# EAGLE design toyotune_3s_tsop (EAGLE 5.11)

## Sheet 1 of 4
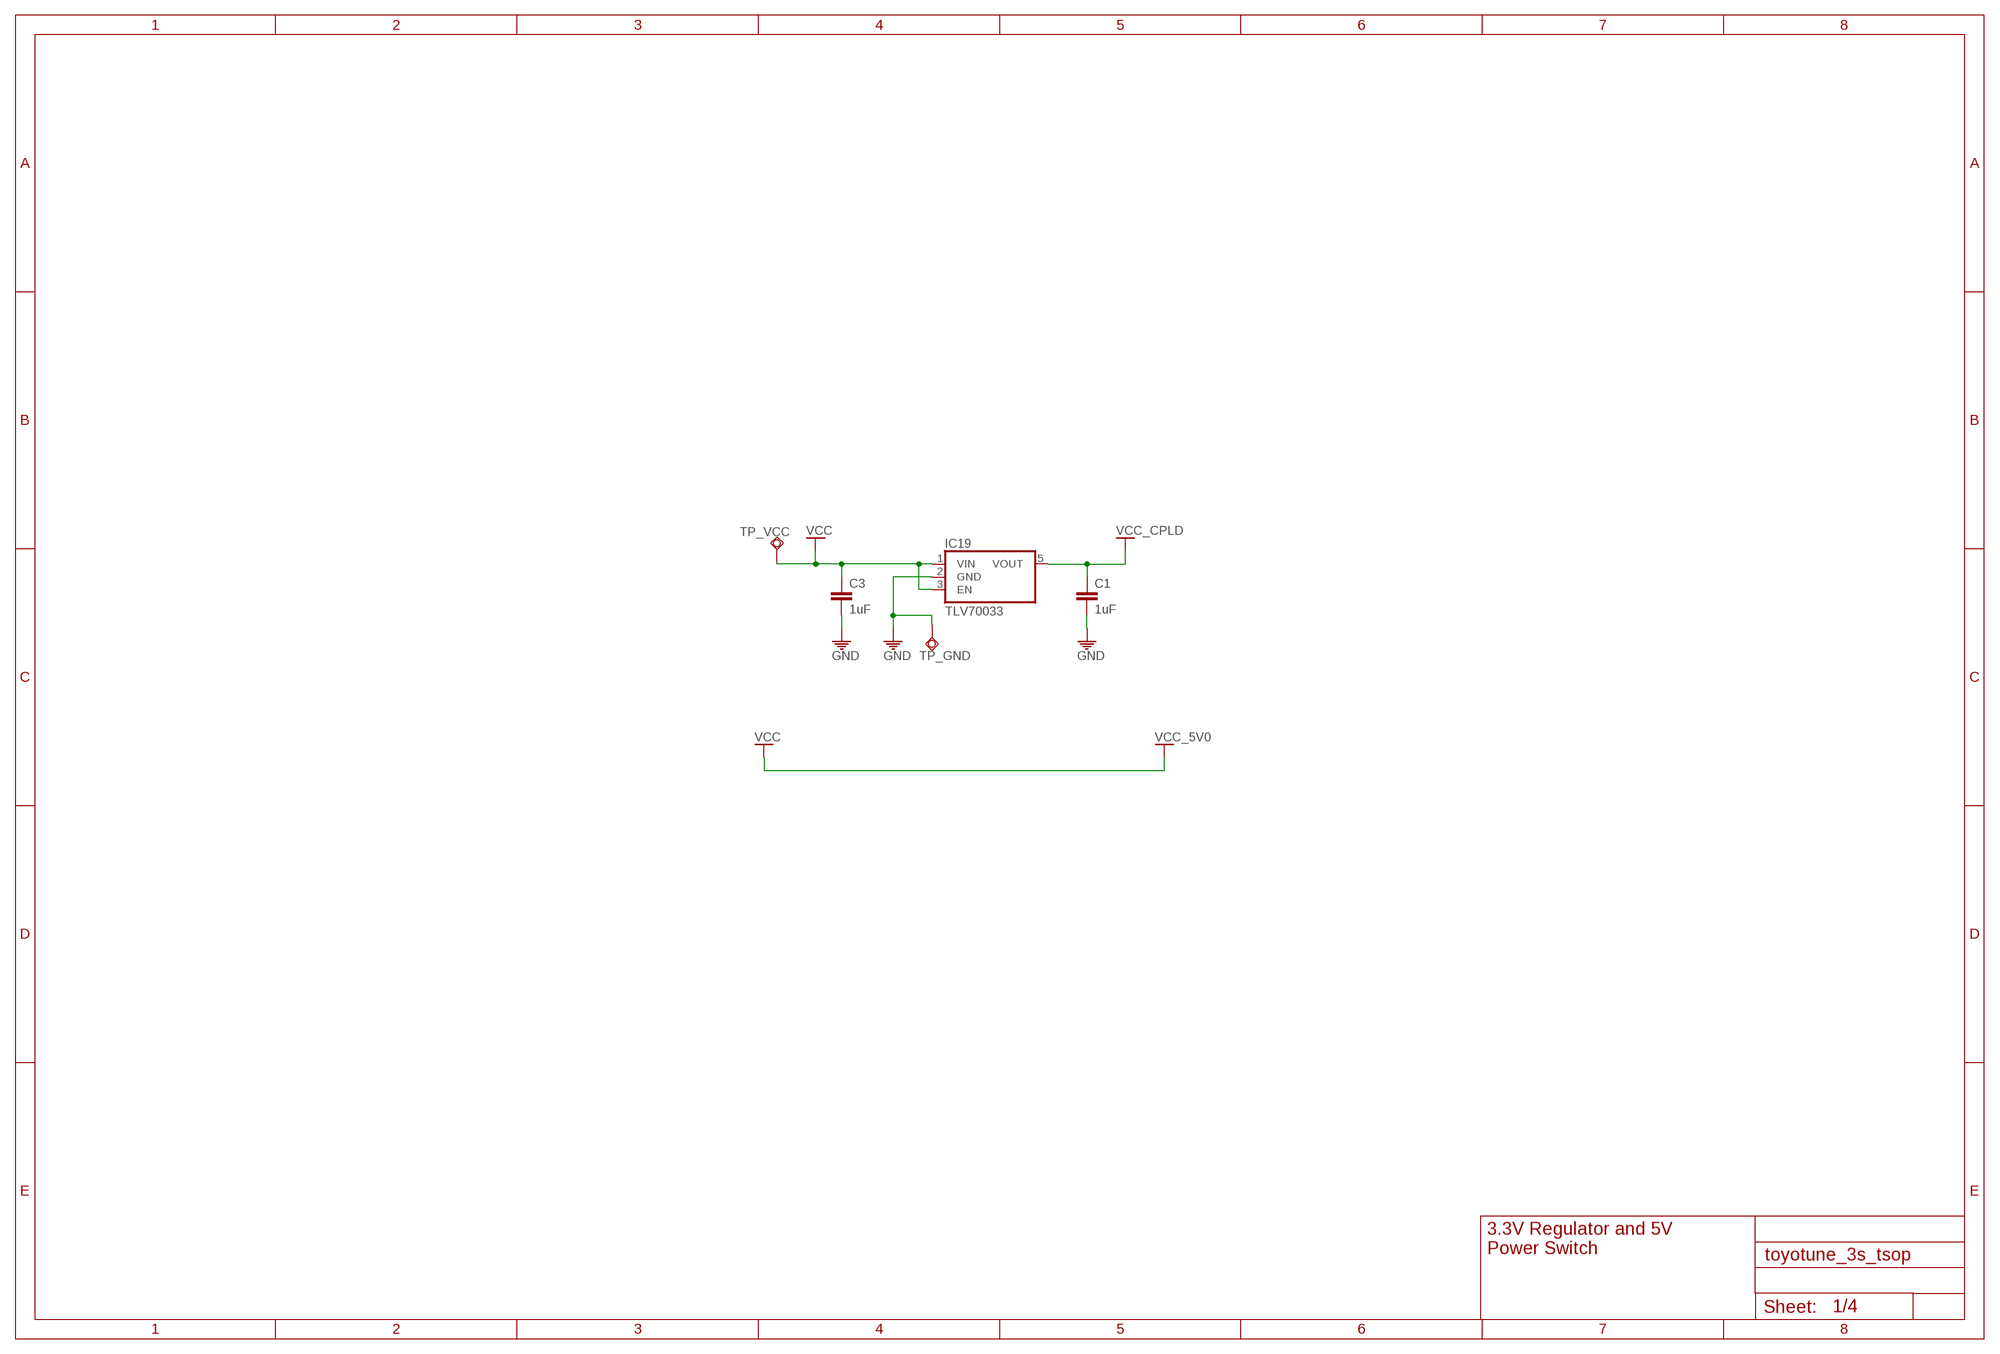
[diagram p0: schematic, sheet 1]

### Parts
C1  1uF  C-EUC0603  [C0603]
C3  1uF  C-EUC0603  [C0603]
IC19  TLV70033  [DDC_R-PDSO-G5]
TP_GND  TPSQTP12SQ  [TP12SQ]
TP_VCC  TPSQTP12SQ  [TP12SQ]

### Nets
GND: C1.2 C3.2 IC19.2(GND) TP_GND.TP ; also sheet 2,3,4
VCC: C3.1 IC19.1(VIN) IC19.3(EN) TP_VCC.TP ; supply symbol labelled VCC_5V0 ; also sheet 2,3,4
VCC_CPLD: C1.1 IC19.5(VOUT) ; also sheet 3,4

### Notes on the sheet
- 3.3V Regulator and 5V
- Power Switch

## Sheet 2 of 4
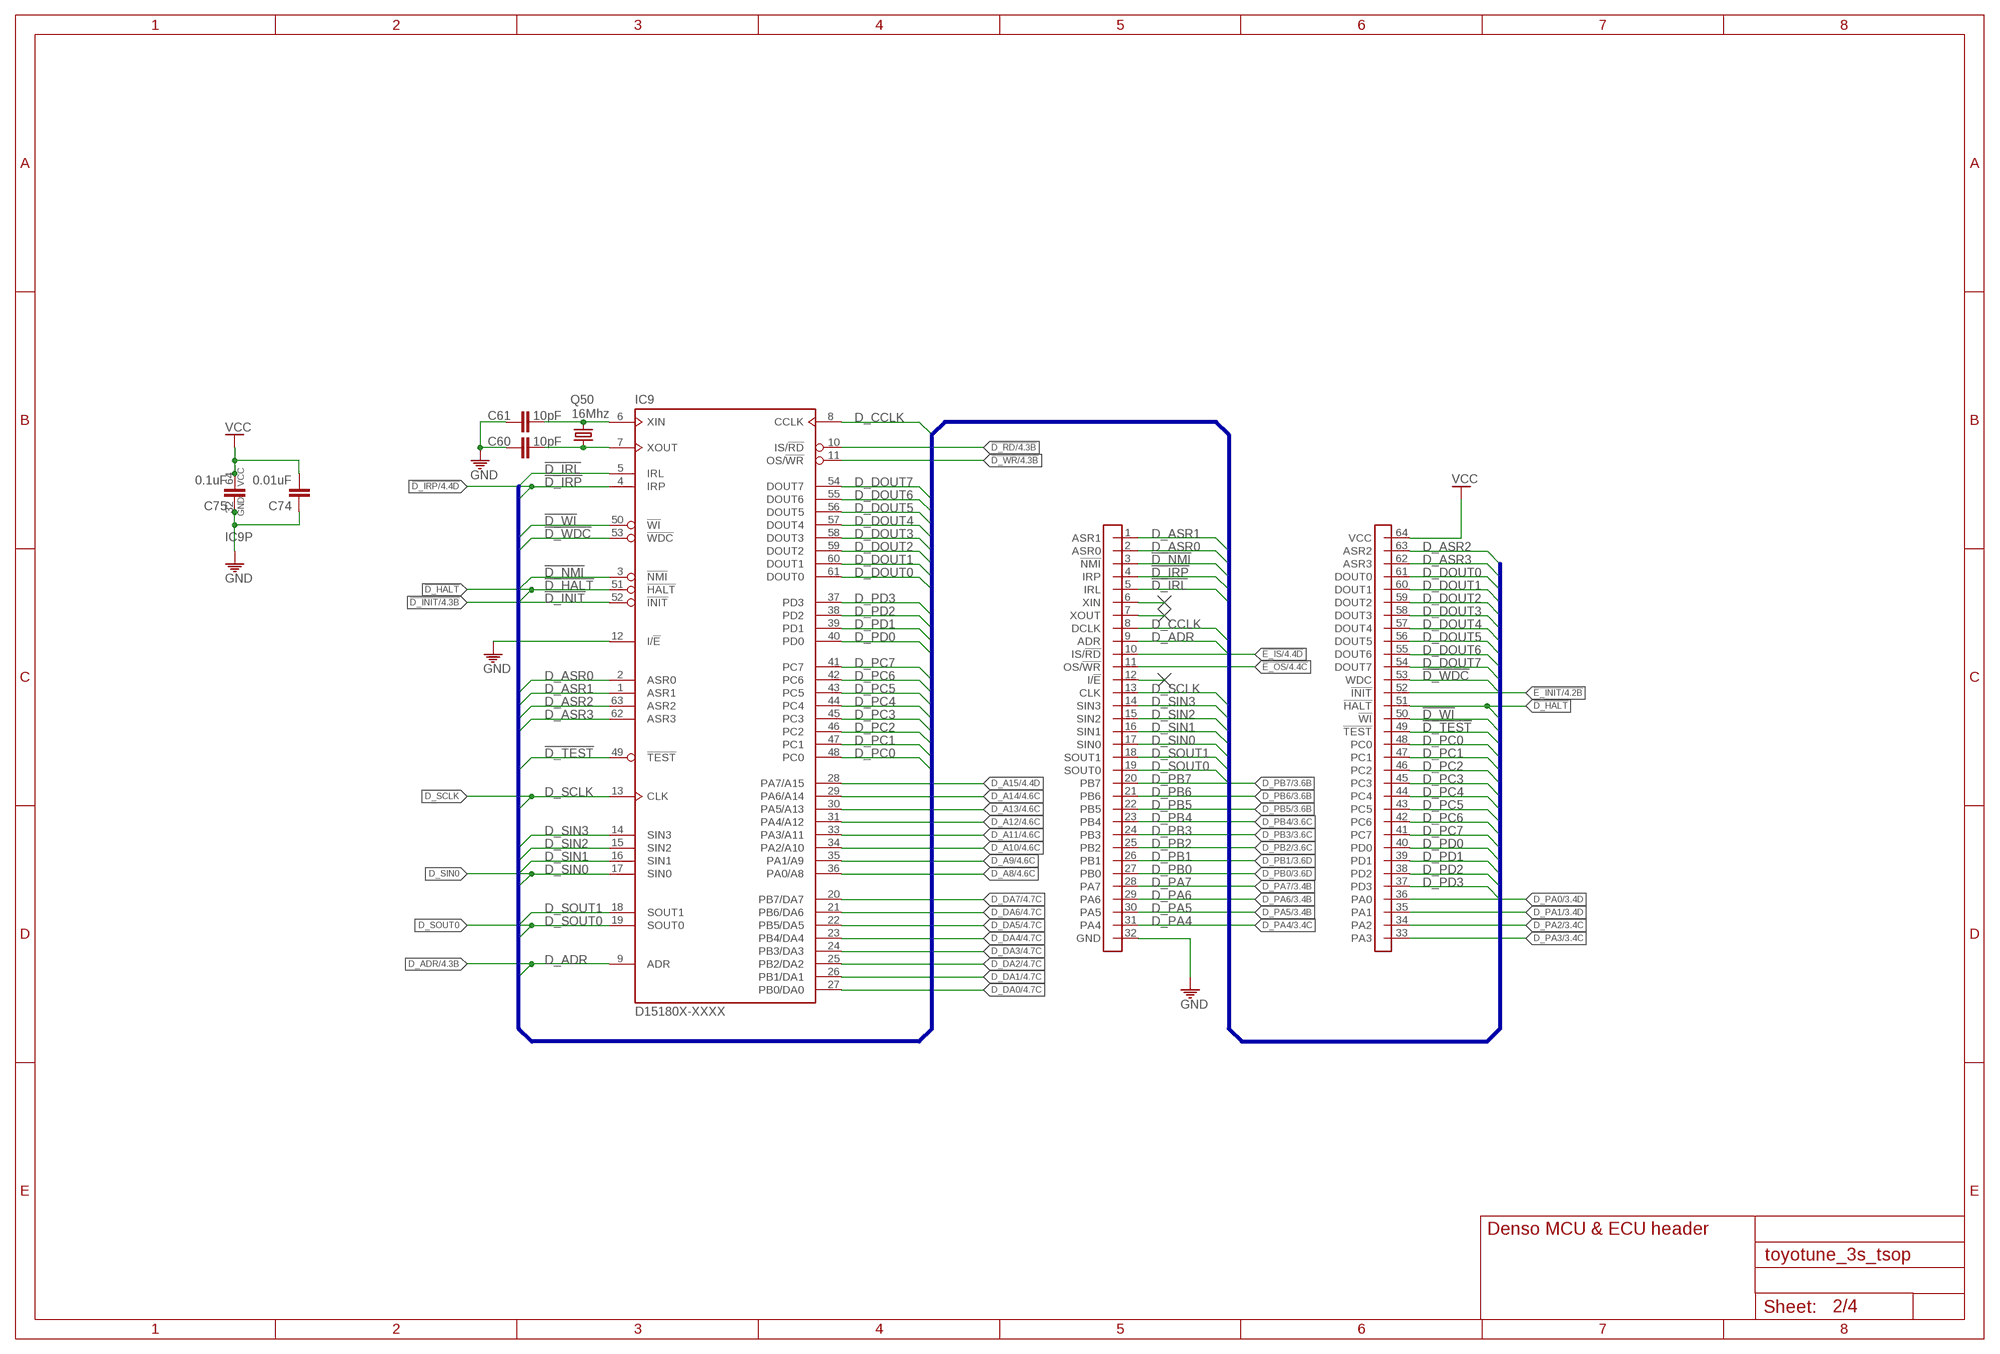
[diagram p1: schematic, sheet 2]

### Parts
C60  10pF  C-EUC0603  [C0603]
C61  10pF  C-EUC0603  [C0603]
C74  0.01uF  C-EUC0603  [C0603]
C75  0.1uF  C-EUC0603  [C0603]
IC9  D15180X-XXXX  D151803-9661  [SDIP-64]
Q50  16Mhz  CRYSTAL5X3  [CRYSTAL-SMD-5X3]
U1  D151803-CONN  [SDIP-64-CONN]

### Nets
!D_HALT: IC9.51(:!HALT) U1.51(!HALT)
!D_INIT: IC9.52(:!INIT) ; also sheet 4
!D_IRL: IC9.5(:IRL) U1.5(IRL)
!D_IRP: IC9.4(:IRP) U1.4(IRP) ; also sheet 4
!D_NMI: IC9.3(:!NMI) U1.3(!NMI)
!D_RD: IC9.10(:IS/!RD) ; also sheet 4
!D_TEST: IC9.49(:!TEST) U1.49(!TEST)
!D_WDC: IC9.53(:!WDC) U1.53(WDC)
!D_WI: IC9.50(:!WI) U1.50(!WI)
!D_WR: IC9.11(:OS/!WR) ; also sheet 4
!E_INIT: U1.52(!INIT) ; also sheet 4
!E_IS: U1.10(IS/!RD) ; also sheet 4
!E_OS: U1.11(OS/!WR) ; also sheet 4
D1_XIN: C61.2 IC9.6(:XIN) Q50.3
D1_XOUT: C60.1 IC9.7(:XOUT) Q50.1
D_A8: IC9.36(:PA0/A8) ; also sheet 4
D_A9: IC9.35(:PA1/A9) ; also sheet 4
D_A10: IC9.34(:PA2/A10) ; also sheet 4
D_A11: IC9.33(:PA3/A11) ; also sheet 4
D_A12: IC9.31(:PA4/A12) ; also sheet 4
D_A13: IC9.30(:PA5/A13) ; also sheet 4
D_A14: IC9.29(:PA6/A14) ; also sheet 4
D_A15: IC9.28(:PA7/A15) ; also sheet 4
D_ADR: IC9.9(:ADR) U1.9(ADR) ; also sheet 4
D_ASR0: IC9.2(:ASR0) U1.2(ASR0)
D_ASR1: IC9.1(:ASR1) U1.1(ASR1)
D_ASR2: IC9.63(:ASR2) U1.63(ASR2)
D_ASR3: IC9.62(:ASR3) U1.62(ASR3)
D_CCLK: IC9.8(:CCLK) U1.8(DCLK) ; also sheet 4
D_DA0: IC9.27(:PB0/DA0) ; also sheet 4
D_DA1: IC9.26(:PB1/DA1) ; also sheet 4
D_DA2: IC9.25(:PB2/DA2) ; also sheet 4
D_DA3: IC9.24(:PB3/DA3) ; also sheet 4
D_DA4: IC9.23(:PB4/DA4) ; also sheet 4
D_DA5: IC9.22(:PB5/DA5) ; also sheet 4
D_DA6: IC9.21(:PB6/DA6) ; also sheet 4
D_DA7: IC9.20(:PB7/DA7) ; also sheet 4
D_DOUT0: IC9.61(:DOUT0) U1.61(DOUT0)
D_DOUT1: IC9.60(:DOUT1) U1.60(DOUT1)
D_DOUT2: IC9.59(:DOUT2) U1.59(DOUT2)
D_DOUT3: IC9.58(:DOUT3) U1.58(DOUT3)
D_DOUT4: IC9.57(:DOUT4) U1.57(DOUT4)
D_DOUT5: IC9.56(:DOUT5) U1.56(DOUT5)
D_DOUT6: IC9.55(:DOUT6) U1.55(DOUT6)
D_DOUT7: IC9.54(:DOUT7) U1.54(DOUT7)
D_PA0: U1.36(PA0) ; also sheet 3
D_PA1: U1.35(PA1) ; also sheet 3
D_PA2: U1.34(PA2) ; also sheet 3
D_PA3: U1.33(PA3) ; also sheet 3
D_PA4: U1.31(PA4) ; also sheet 3
D_PA5: U1.30(PA5) ; also sheet 3
D_PA6: U1.29(PA6) ; also sheet 3
D_PA7: U1.28(PA7) ; also sheet 3
D_PB0: U1.27(PB0) ; also sheet 3
D_PB1: U1.26(PB1) ; also sheet 3
D_PB2: U1.25(PB2) ; also sheet 3
D_PB3: U1.24(PB3) ; also sheet 3
D_PB4: U1.23(PB4) ; also sheet 3
D_PB5: U1.22(PB5) ; also sheet 3
D_PB6: U1.21(PB6) ; also sheet 3
D_PB7: U1.20(PB7) ; also sheet 3
D_PC0: IC9.48(:PC0) U1.48(PC0)
D_PC1: IC9.47(:PC1) U1.47(PC1)
D_PC2: IC9.46(:PC2) U1.46(PC2)
D_PC3: IC9.45(:PC3) U1.45(PC3)
D_PC4: IC9.44(:PC4) U1.44(PC4)
D_PC5: IC9.43(:PC5) U1.43(PC5)
D_PC6: IC9.42(:PC6) U1.42(PC6)
D_PC7: IC9.41(:PC7) U1.41(PC7)
D_PD0: IC9.40(:PD0) U1.40(PD0)
D_PD1: IC9.39(:PD1) U1.39(PD1)
D_PD2: IC9.38(:PD2) U1.38(PD2)
D_PD3: IC9.37(:PD3) U1.37(PD3)
D_SCLK: IC9.13(:CLK) U1.13(CLK)
D_SIN0: IC9.17(:SIN0) U1.17(SIN0)
D_SIN1: IC9.16(:SIN1) U1.16(SIN1)
D_SIN2: IC9.15(:SIN2) U1.15(SIN2)
D_SIN3: IC9.14(:SIN3) U1.14(SIN3)
D_SOUT0: IC9.19(:SOUT0) U1.19(SOUT0)
D_SOUT1: IC9.18(:SOUT1) U1.18(SOUT1)
GND: C60.2 C61.1 C74.1 C75.1 IC9.12(:I/!E) IC9.32(P:GND) U1.32(GND) ; also sheet 1,3,4
N$28: U1.6(XIN)
N$29: U1.7(XOUT)
N$30: U1.12(I/!E)
VCC: C74.2 C75.2 IC9.64(P:VCC) U1.64(VCC) ; also sheet 1,3,4

### Buses
!D_IRL,!D_IRP,!D_WI,!D_WDC,!D_NMI,!D_HALT,!D1_INIT,D_ASR[0..3],!D_TEST,D_PC[0..7],D_PD[0..3],D_ADR,D_SIN[0..3],D_SOUT[0..1],D_SCLK,D_CCLK,D_DOUT[0..7]

### Notes on the sheet
- Denso MCU & ECU header

## Sheet 3 of 4
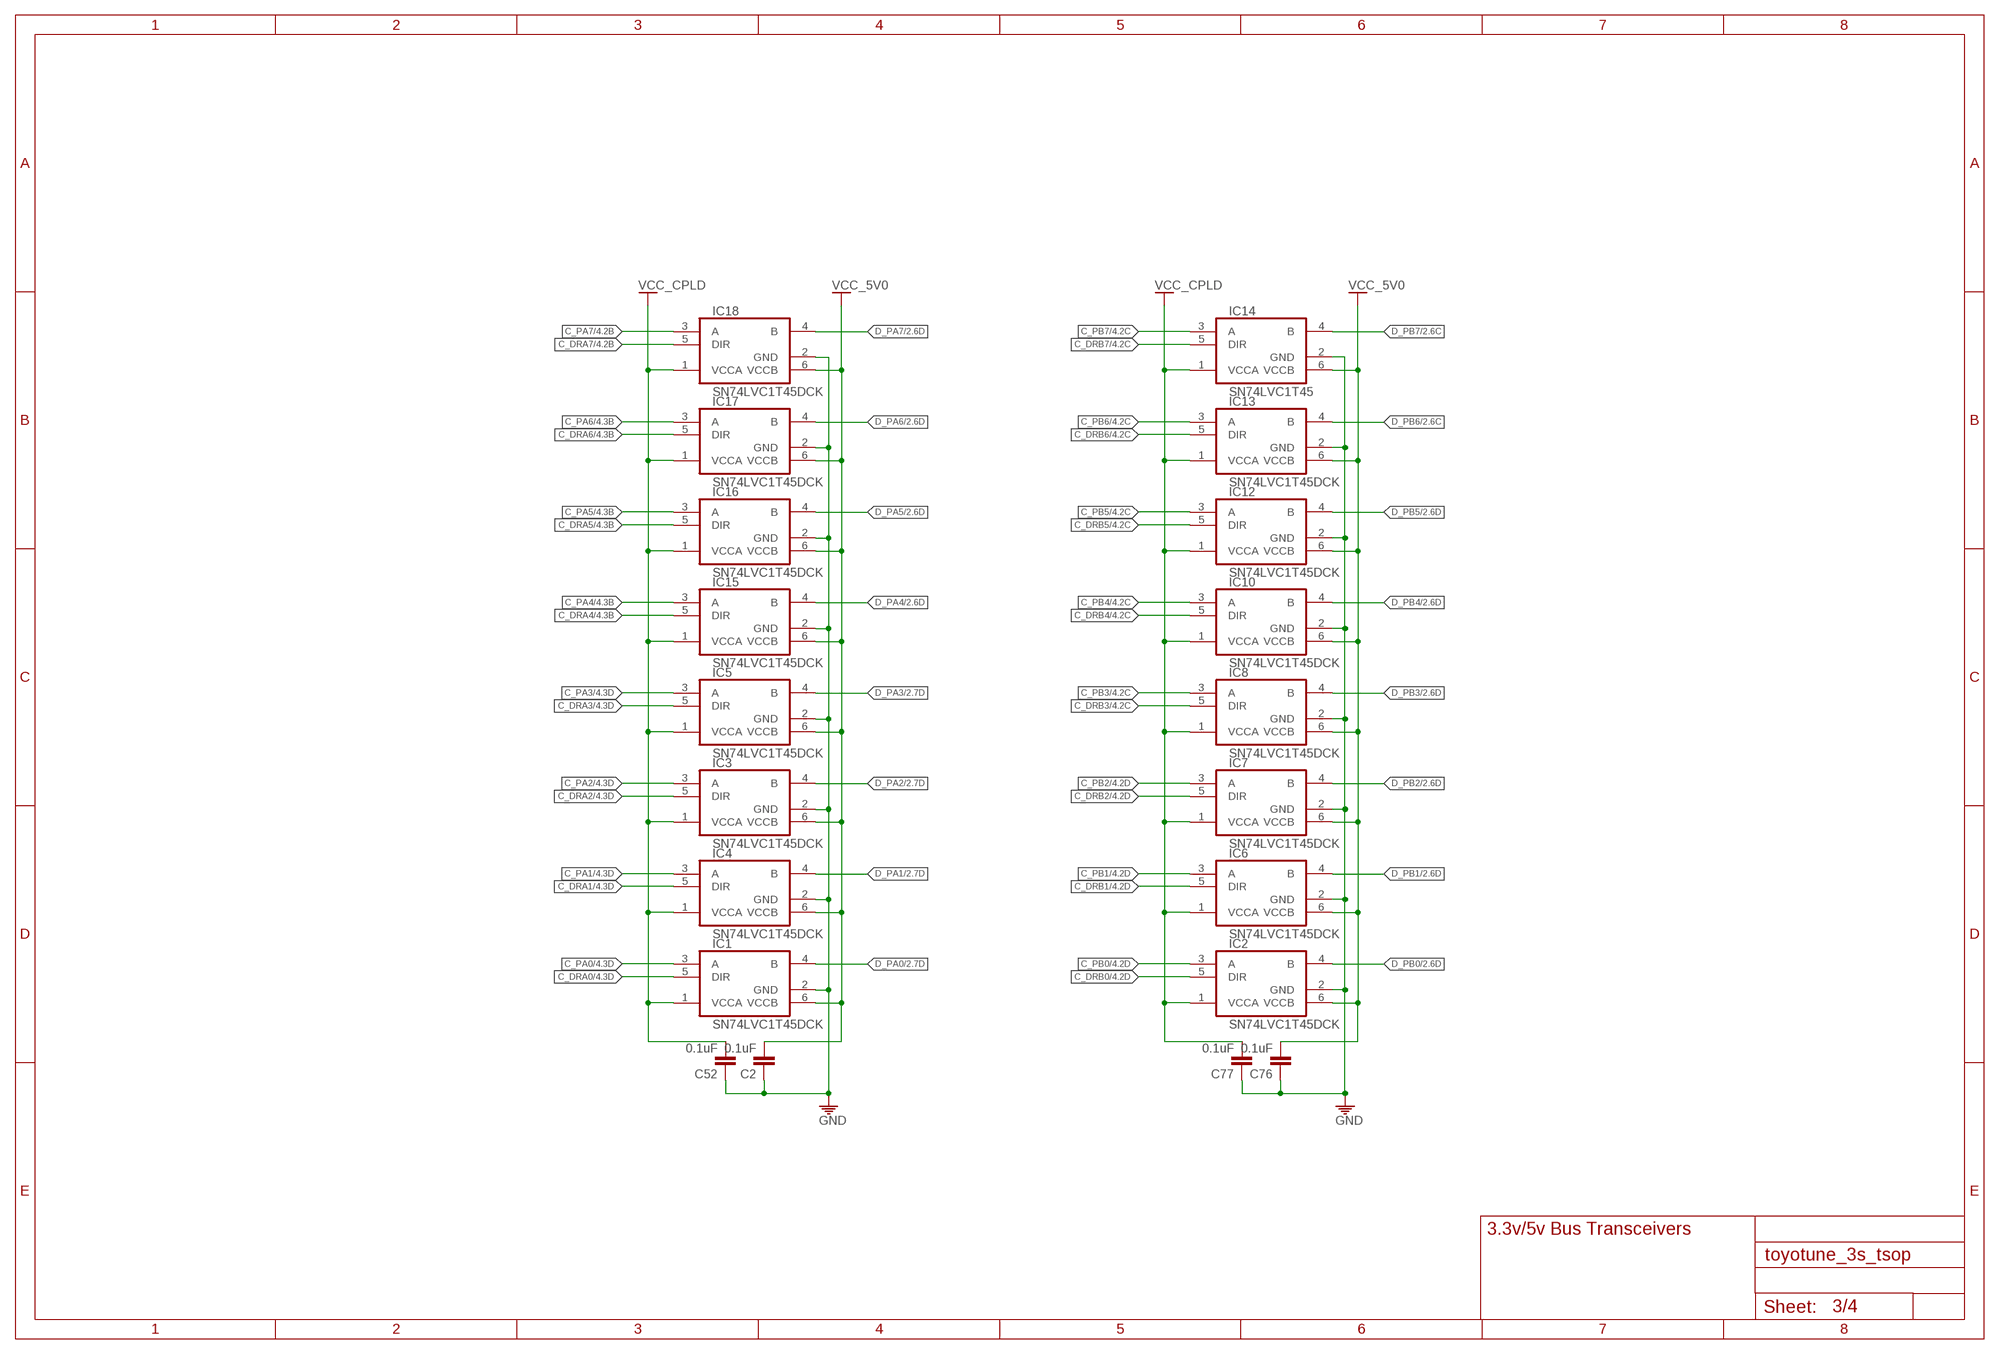
[diagram p2: schematic, sheet 3]

### Parts
C2  0.1uF  C-EUC0603  [C0603]
C52  0.1uF  C-EUC0603  [C0603]
C76  0.1uF  C-EUC0603  [C0603]
C77  0.1uF  C-EUC0603  [C0603]
IC1  SN74LVC1T45DCK  [DCK_R-PDSO-G6]
IC2  SN74LVC1T45DCK  [DCK_R-PDSO-G6]
IC3  SN74LVC1T45DCK  [DCK_R-PDSO-G6]
IC4  SN74LVC1T45DCK  [DCK_R-PDSO-G6]
IC5  SN74LVC1T45DCK  [DCK_R-PDSO-G6]
IC6  SN74LVC1T45DCK  [DCK_R-PDSO-G6]
IC7  SN74LVC1T45DCK  [DCK_R-PDSO-G6]
IC8  SN74LVC1T45DCK  [DCK_R-PDSO-G6]
IC10  SN74LVC1T45DCK  [DCK_R-PDSO-G6]
IC12  SN74LVC1T45DCK  [DCK_R-PDSO-G6]
IC13  SN74LVC1T45DCK  [DCK_R-PDSO-G6]
IC14  SN74LVC1T45  SN74LVC1T45DCK  [DCK_R-PDSO-G6]
IC15  SN74LVC1T45DCK  [DCK_R-PDSO-G6]
IC16  SN74LVC1T45DCK  [DCK_R-PDSO-G6]
IC17  SN74LVC1T45DCK  [DCK_R-PDSO-G6]
IC18  SN74LVC1T45DCK  [DCK_R-PDSO-G6]

### Nets
C_DRA0: IC1.5(DIR) ; also sheet 4
C_DRA1: IC4.5(DIR) ; also sheet 4
C_DRA2: IC3.5(DIR) ; also sheet 4
C_DRA3: IC5.5(DIR) ; also sheet 4
C_DRA4: IC15.5(DIR) ; also sheet 4
C_DRA5: IC16.5(DIR) ; also sheet 4
C_DRA6: IC17.5(DIR) ; also sheet 4
C_DRA7: IC18.5(DIR) ; also sheet 4
C_DRB0: IC2.5(DIR) ; also sheet 4
C_DRB1: IC6.5(DIR) ; also sheet 4
C_DRB2: IC7.5(DIR) ; also sheet 4
C_DRB3: IC8.5(DIR) ; also sheet 4
C_DRB4: IC10.5(DIR) ; also sheet 4
C_DRB5: IC12.5(DIR) ; also sheet 4
C_DRB6: IC13.5(DIR) ; also sheet 4
C_DRB7: IC14.5(DIR) ; also sheet 4
C_PA0: IC1.3(A) ; also sheet 4
C_PA1: IC4.3(A) ; also sheet 4
C_PA2: IC3.3(A) ; also sheet 4
C_PA3: IC5.3(A) ; also sheet 4
C_PA4: IC15.3(A) ; also sheet 4
C_PA5: IC16.3(A) ; also sheet 4
C_PA6: IC17.3(A) ; also sheet 4
C_PA7: IC18.3(A) ; also sheet 4
C_PB0: IC2.3(A) ; also sheet 4
C_PB1: IC6.3(A) ; also sheet 4
C_PB2: IC7.3(A) ; also sheet 4
C_PB3: IC8.3(A) ; also sheet 4
C_PB4: IC10.3(A) ; also sheet 4
C_PB5: IC12.3(A) ; also sheet 4
C_PB6: IC13.3(A) ; also sheet 4
C_PB7: IC14.3(A) ; also sheet 4
D_PA0: IC1.4(B) ; also sheet 2
D_PA1: IC4.4(B) ; also sheet 2
D_PA2: IC3.4(B) ; also sheet 2
D_PA3: IC5.4(B) ; also sheet 2
D_PA4: IC15.4(B) ; also sheet 2
D_PA5: IC16.4(B) ; also sheet 2
D_PA6: IC17.4(B) ; also sheet 2
D_PA7: IC18.4(B) ; also sheet 2
D_PB0: IC2.4(B) ; also sheet 2
D_PB1: IC6.4(B) ; also sheet 2
D_PB2: IC7.4(B) ; also sheet 2
D_PB3: IC8.4(B) ; also sheet 2
D_PB4: IC10.4(B) ; also sheet 2
D_PB5: IC12.4(B) ; also sheet 2
D_PB6: IC13.4(B) ; also sheet 2
D_PB7: IC14.4(B) ; also sheet 2
GND: C2.1 C52.1 C76.1 C77.1 IC1.2(GND) IC2.2(GND) IC3.2(GND) IC4.2(GND) IC5.2(GND) IC6.2(GND) IC7.2(GND) IC8.2(GND) IC10.2(GND) IC12.2(GND) IC13.2(GND) IC14.2(GND) IC15.2(GND) IC16.2(GND) IC17.2(GND) IC18.2(GND) ; also sheet 1,2,4
VCC: C2.2 C76.2 IC1.6(VCCB) IC2.6(VCCB) IC3.6(VCCB) IC4.6(VCCB) IC5.6(VCCB) IC6.6(VCCB) IC7.6(VCCB) IC8.6(VCCB) IC10.6(VCCB) IC12.6(VCCB) IC13.6(VCCB) IC14.6(VCCB) IC15.6(VCCB) IC16.6(VCCB) IC17.6(VCCB) IC18.6(VCCB) ; supply symbol labelled VCC_5V0 ; also sheet 1,2,4
VCC_CPLD: C52.2 C77.2 IC1.1(VCCA) IC2.1(VCCA) IC3.1(VCCA) IC4.1(VCCA) IC5.1(VCCA) IC6.1(VCCA) IC7.1(VCCA) IC8.1(VCCA) IC10.1(VCCA) IC12.1(VCCA) IC13.1(VCCA) IC14.1(VCCA) IC15.1(VCCA) IC16.1(VCCA) IC17.1(VCCA) IC18.1(VCCA) ; also sheet 1,4

### Notes on the sheet
- 3.3v/5v Bus Transceivers

## Sheet 4 of 4
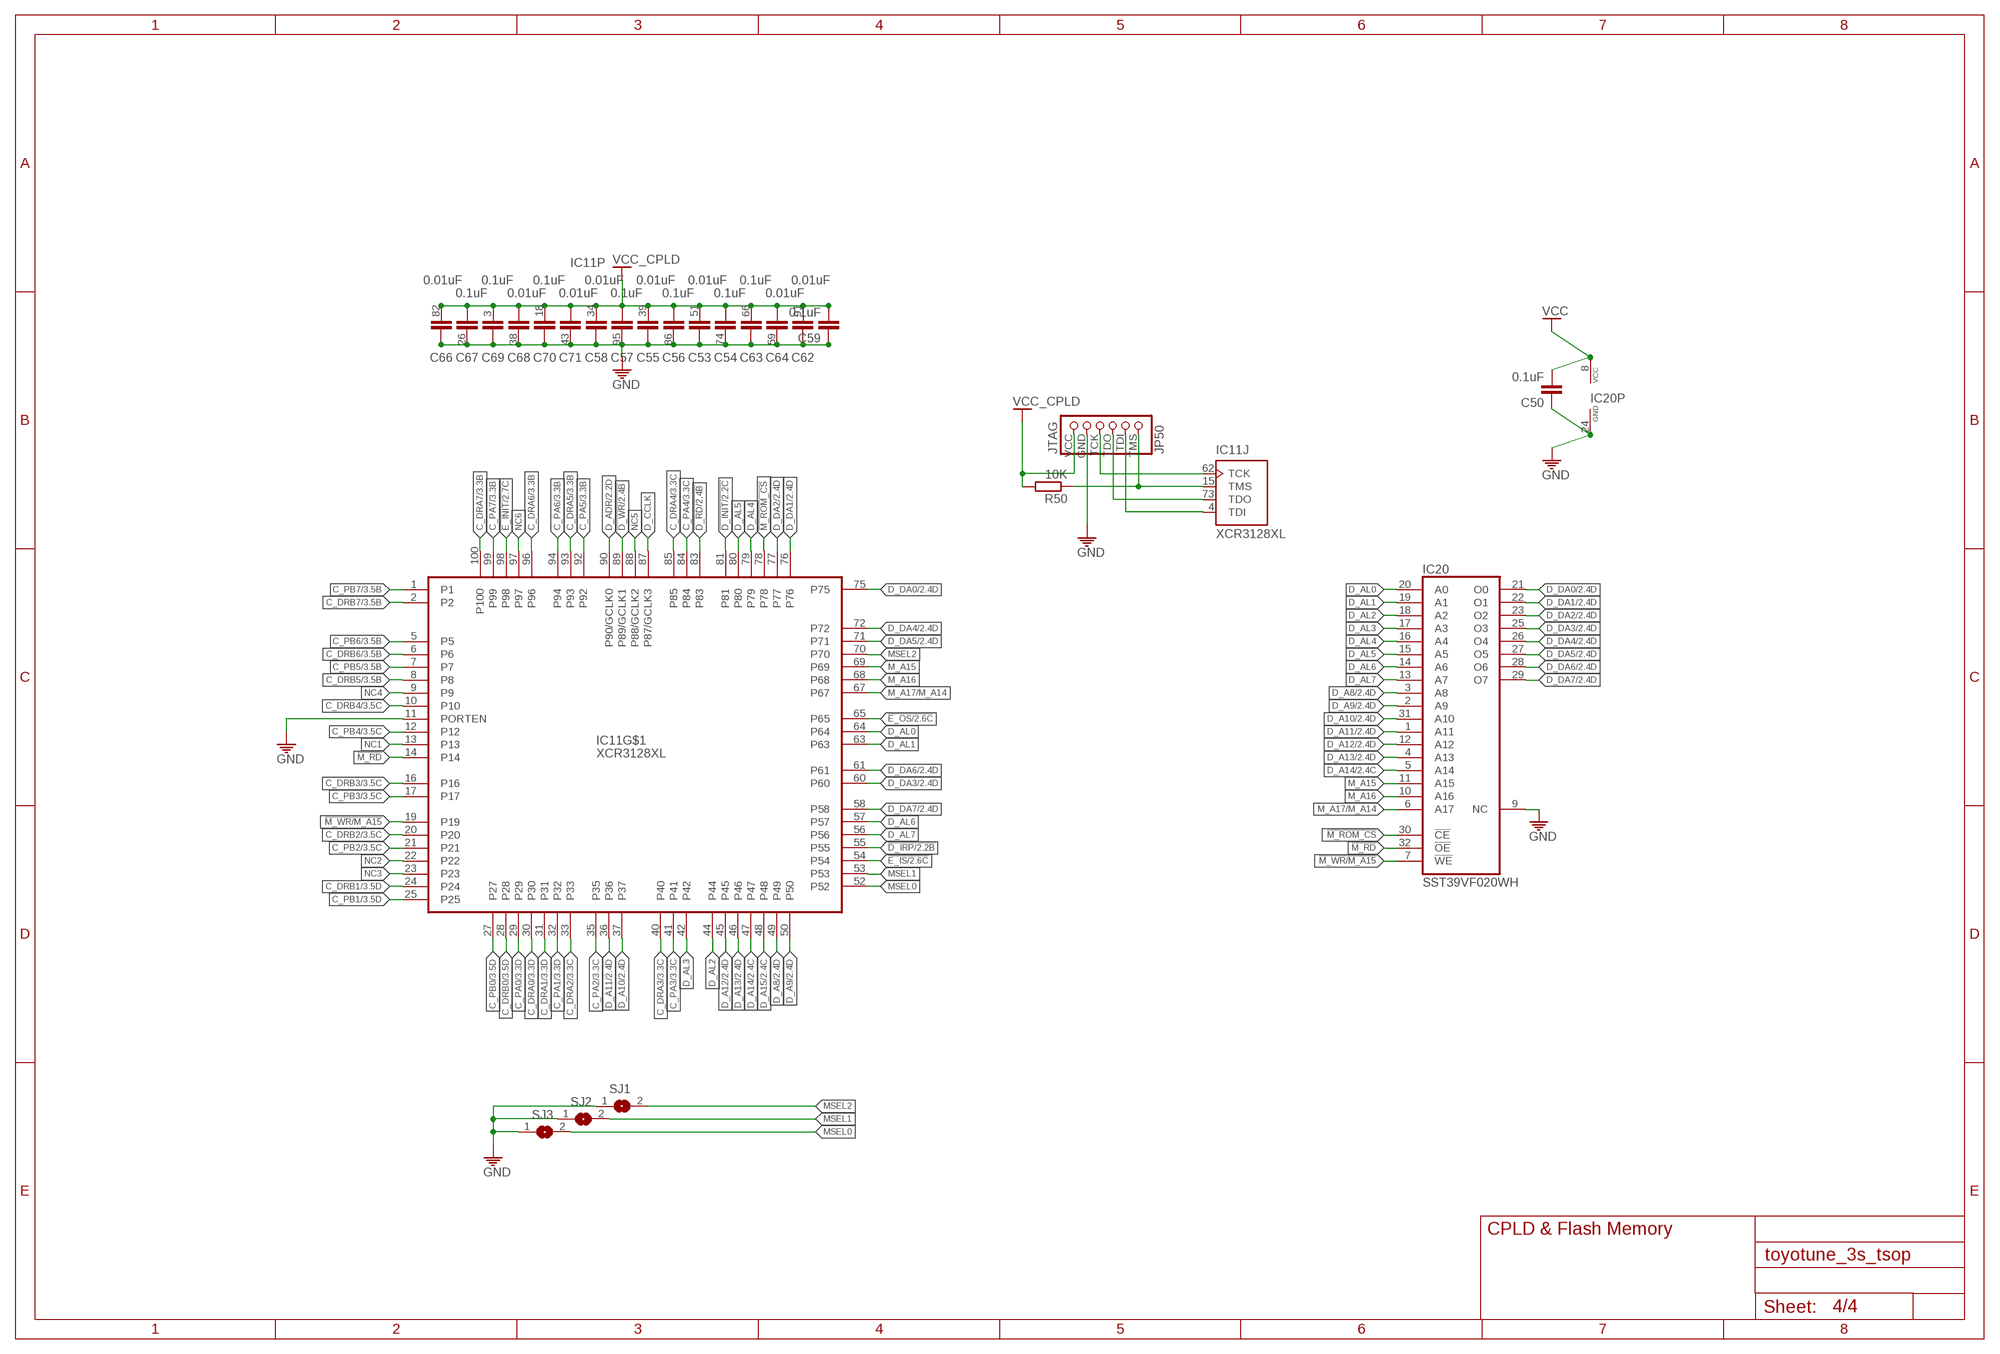
[diagram p3: schematic, sheet 4]

### Parts
C50  0.1uF  C-EUC0603  [C0603]
C53  0.01uF  C-EUC0603  [C0603]
C54  0.1uF  C-EUC0603  [C0603]
C55  0.01uF  C-EUC0603  [C0603]
C56  0.1uF  C-EUC0603  [C0603]
C57  0.1uF  C-EUC0603  [C0603]
C58  0.01uF  C-EUC0603  [C0603]
C59  0.1uF  C-EUC0603  [C0603]
C62  0.01uF  C-EUC0603  [C0603]
C63  0.1uF  C-EUC0603  [C0603]
C64  0.01uF  C-EUC0603  [C0603]
C66  0.01uF  C-EUC0603  [C0603]
C67  0.1uF  C-EUC0603  [C0603]
C68  0.01uF  C-EUC0603  [C0603]
C69  0.1uF  C-EUC0603  [C0603]
C70  0.1uF  C-EUC0603  [C0603]
C71  0.01uF  C-EUC0603  [C0603]
IC11  XCR3128XL  [VQ100]
IC20  SST39VF020WH  [TSOP32]
JP50  JTAG  JTAG_HEADERS  [1X06_SMD]
R50  10K  R-EU_R0603  [R0603]
SJ1  SJ  [SJ]
SJ2  SJ  [SJ]
SJ3  SJ  [SJ]

### Nets
!D_INIT: IC11.81 ; also sheet 2
!D_IRP: IC11.55 ; also sheet 2
!D_RD: IC11.83 ; also sheet 2
!D_WR: IC11.89(P89/GCLK1) ; also sheet 2
!E_INIT: IC11.98 ; also sheet 2
!E_IS: IC11.54 ; also sheet 2
!E_OS: IC11.65 ; also sheet 2
!M_RD: IC11.14 IC20.32(!OE)
!M_ROM_CS: IC11.78 IC20.30(!CE)
!M_WR/M_A15: IC11.19 IC20.7(!WE)
C_DRA0: IC11.30 ; also sheet 3
C_DRA1: IC11.31 ; also sheet 3
C_DRA2: IC11.33 ; also sheet 3
C_DRA3: IC11.40 ; also sheet 3
C_DRA4: IC11.85 ; also sheet 3
C_DRA5: IC11.93 ; also sheet 3
C_DRA6: IC11.96 ; also sheet 3
C_DRA7: IC11.100 ; also sheet 3
C_DRB0: IC11.28 ; also sheet 3
C_DRB1: IC11.24 ; also sheet 3
C_DRB2: IC11.20 ; also sheet 3
C_DRB3: IC11.16 ; also sheet 3
C_DRB4: IC11.10 ; also sheet 3
C_DRB5: IC11.8 ; also sheet 3
C_DRB6: IC11.6 ; also sheet 3
C_DRB7: IC11.2 ; also sheet 3
C_PA0: IC11.29 ; also sheet 3
C_PA1: IC11.32 ; also sheet 3
C_PA2: IC11.35 ; also sheet 3
C_PA3: IC11.41 ; also sheet 3
C_PA4: IC11.84 ; also sheet 3
C_PA5: IC11.92 ; also sheet 3
C_PA6: IC11.94 ; also sheet 3
C_PA7: IC11.99 ; also sheet 3
C_PB0: IC11.27 ; also sheet 3
C_PB1: IC11.25 ; also sheet 3
C_PB2: IC11.21 ; also sheet 3
C_PB3: IC11.17 ; also sheet 3
C_PB4: IC11.12 ; also sheet 3
C_PB5: IC11.7 ; also sheet 3
C_PB6: IC11.5 ; also sheet 3
C_PB7: IC11.1 ; also sheet 3
D_A8: IC11.49 IC20.3(A8) ; also sheet 2
D_A9: IC11.50 IC20.2(A9) ; also sheet 2
D_A10: IC11.37 IC20.31(A10) ; also sheet 2
D_A11: IC11.36 IC20.1(A11) ; also sheet 2
D_A12: IC11.45 IC20.12(A12) ; also sheet 2
D_A13: IC11.46 IC20.4(A13) ; also sheet 2
D_A14: IC11.47 IC20.5(A14) ; also sheet 2
D_A15: IC11.48 ; also sheet 2
D_ADR: IC11.90(P90/GCLK0) ; also sheet 2
D_AL0: IC11.64 IC20.20(A0)
D_AL1: IC11.63 IC20.19(A1)
D_AL2: IC11.44 IC20.18(A2)
D_AL3: IC11.42 IC20.17(A3)
D_AL4: IC11.79 IC20.16(A4)
D_AL5: IC11.80 IC20.15(A5)
D_AL6: IC11.57 IC20.14(A6)
D_AL7: IC11.56 IC20.13(A7)
D_CCLK: IC11.87(P87/GCLK3) ; also sheet 2
D_DA0: IC11.75 IC20.21(O0) ; also sheet 2
D_DA1: IC11.76 IC20.22(O1) ; also sheet 2
D_DA2: IC11.77 IC20.23(O2) ; also sheet 2
D_DA3: IC11.60 IC20.25(O3) ; also sheet 2
D_DA4: IC11.72 IC20.26(O4) ; also sheet 2
D_DA5: IC11.71 IC20.27(O5) ; also sheet 2
D_DA6: IC11.61 IC20.28(O6) ; also sheet 2
D_DA7: IC11.58 IC20.29(O7) ; also sheet 2
GND: C50.1 C53.1 C54.1 C55.1 C56.1 C57.1 C58.1 C59.1 C62.1 C63.1 C64.1 C66.1 C67.1 C68.1 C69.1 C70.1 C71.1 IC11.11(PORTEN) IC11.26(P:GND) IC11.38(P:GND) IC11.43(P:GND) IC11.59(P:GND) IC11.74(P:GND) IC11.86(P:GND) IC11.95(P:GND) IC20.9(NC) IC20.24(GND) JP50.GND SJ1.1 SJ2.1 SJ3.1 ; also sheet 1,2,3
M_A15: IC11.69 IC20.11(A15)
M_A16: IC11.68 IC20.10(A16)
M_A17/M_A14: IC11.67 IC20.6(A17)
MSEL0: IC11.52 SJ3.2
MSEL1: IC11.53 SJ2.2
MSEL2: IC11.70 SJ1.2
NC1: IC11.13
NC2: IC11.22
NC3: IC11.23
NC4: IC11.9
NC5: IC11.88(P88/GCLK2)
NC6: IC11.97
TCK: IC11.62(J:TCK) JP50.TCK
TDI: IC11.4(J:TDI) JP50.TDI
TDO: IC11.73(J:TDO) JP50.TDO
TMS: IC11.15(J:TMS) JP50.TMS R50.1
VCC: C50.2 IC20.8(VCC) ; also sheet 1,2,3
VCC_CPLD: C53.2 C54.2 C55.2 C56.2 C57.2 C58.2 C59.2 C62.2 C63.2 C64.2 C66.2 C67.2 C68.2 C69.2 C70.2 C71.2 IC11.3(P:VCC_3V3) IC11.18(P:VCC_3V3) IC11.34(P:VCC_3V3) IC11.39(P:VCC_3V3) IC11.51(P:VCC_3V3) IC11.66(P:VCC_3V3) IC11.82(P:VCC_3V3) IC11.91(P:VCC_3V3) JP50.VCC R50.2 ; also sheet 1,3

### Notes on the sheet
- CPLD & Flash Memory

## Library data of the parts
C1-C3 C50 C52-C64 C66-C71 C74-C77 = toyotune:C-EU: CAPACITOR, European symbol
IC1-IC8 IC10 IC12-IC18 = toyotune:SN74LVC1T45
IC9 = toyotune:D151803-9661
IC11 = toyotune:XCR3128XL
IC19 = toyota-ecu:TLV70033
IC20 = toyotune:SST39VF020: 2-Megabit FLASH MEMORY (256 K x 8 bit) 2.7-3.6 V
JP50 = toyotune:JTAG_HEADER: PIN HEADER
Q50 = toyotune:CRYSTAL: Crystals Various standard crystals. Proven footprints. Spark Fun Electronics SKU : COM-00534
R50 = toyotune:R-EU_: RESISTOR, European symbol
SJ1-SJ3 = jumper:SJ: SMD solder JUMPER
TP_GND TP_VCC = testpad:TPSQ: Test pad
U1 = toyotune:D151803-CONN

## Board
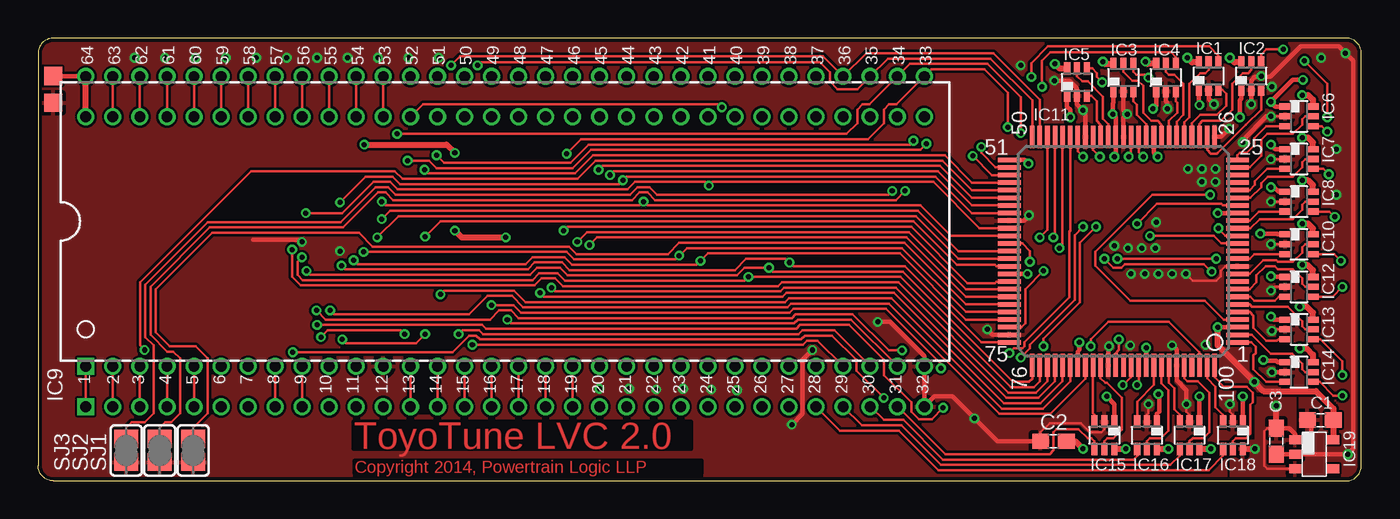
[diagram p4: board, top side]
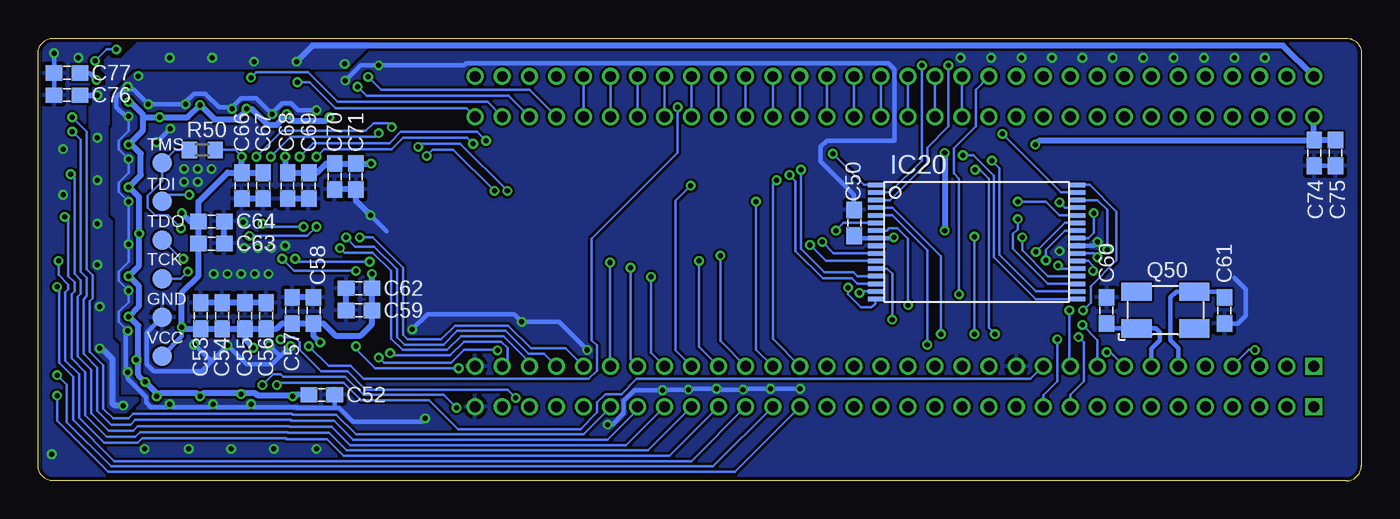
[diagram p5: board, bottom side, seen from below]

Size 87 x 29.1 mm. Coordinates in mm from the lower left corner, seen from the top.
Outline: 1.05,29.1 arc90 0,28.1 0,1 arc90 1,0 86,0 arc90 87,1 87,28.1 arc90 86,29.1 1.05,29.1
Copper layers (1*16): Top 0.035mm / dielectric 1.5mm / Bottom 0.035mm
Design rules "elecrow": minimum track width 6mil, minimum drill 12mil, track to track 6mil, track to pad 6mil, pad to pad 6mil, via to via 6mil, smd to smd 0mil, copper to edge 10mil, drill to drill 10mil, minimum pad ring 8mil, minimum via ring 6mil, stop-mask expansion 2mil, vias tented up to drill 100mil, thermal gap 10mil

### Footprints (pad centres in the part's own frame; a part is rotated, then mirrored left to right if it is on the bottom)
C0603 = smd 1.1 x 1: 1 -0.85,0; 2 0.85,0
DCK_R-PDSO-G6 = smd 0.4 x 0.8: 1 -0.65,-0.9; 2 0,-0.9; 3 0.65,-0.9; 4 0.65,0.9; 5 0,0.9; 6 -0.65,0.9
SDIP-64 = drill 0.711 square: 1 -27.559,-9.525 | drill 0.711 round: 2 -25.781,-9.525; 3 -24.003,-9.525; 4 -22.225,-9.525; 5 -20.447,-9.525; 6 -18.669,-9.525; 7 -16.891,-9.525; 8 -15.113,-9.525; 9 -13.335,-9.525; 10 -11.557,-9.525; 11 -9.779,-9.525; 12 -8.001,-9.525; 13 -6.223,-9.525; 14 -4.445,-9.525; 15 -2.667,-9.525; 16 -0.889,-9.525; 17 0.889,-9.525; 18 2.667,-9.525; 19 4.445,-9.525; 20 6.223,-9.525; 21 8.001,-9.525; 22 9.779,-9.525; 23 11.557,-9.525; 24 13.335,-9.525; 25 15.113,-9.525; 26 16.891,-9.525; 27 18.669,-9.525; 28 20.447,-9.525; 29 22.225,-9.525; 30 24.003,-9.525; 31 25.781,-9.525; 32 27.559,-9.525; 33 27.559,9.525; 34 25.781,9.525; 35 24.003,9.525; 36 22.225,9.525; 37 20.447,9.525; 38 18.669,9.525; 39 16.891,9.525; 40 15.113,9.525; 41 13.335,9.525; 42 11.557,9.525; 43 9.779,9.525; 44 8.001,9.525; 45 6.223,9.525; 46 4.445,9.525; 47 2.667,9.525; 48 0.889,9.525; 49 -0.889,9.525; 50 -2.667,9.525; 51 -4.445,9.525; 52 -6.223,9.525; 53 -8.001,9.525; 54 -9.779,9.525; 55 -11.557,9.525; 56 -13.335,9.525; 57 -15.113,9.525; 58 -16.891,9.525; 59 -18.669,9.525; 60 -20.447,9.525; 61 -22.225,9.525; 62 -24.003,9.525; 63 -25.781,9.525; 64 -27.559,9.525
VQ100 = smd 1.5 x 0.3: 1 -7.5,6; 2 -7.5,5.5; 3 -7.5,5; 4 -7.5,4.5; 5 -7.5,4; 6 -7.5,3.5; 7 -7.5,3; 8 -7.5,2.5; 9 -7.5,2; 10 -7.5,1.5; 11 -7.5,1; 12 -7.5,0.5; 13 -7.5,0; 14 -7.5,-0.5; 15 -7.5,-1; 16 -7.5,-1.5; 17 -7.5,-2; 18 -7.5,-2.5; 19 -7.5,-3; 20 -7.5,-3.5; 21 -7.5,-4; 22 -7.5,-4.5; 23 -7.5,-5; 24 -7.5,-5.5; 25 -7.5,-6; 51 7.5,-6; 52 7.5,-5.5; 53 7.5,-5; 54 7.5,-4.5; 55 7.5,-4; 56 7.5,-3.5; 57 7.5,-3; 58 7.5,-2.5; 59 7.5,-2; 60 7.5,-1.5; 61 7.5,-1; 62 7.5,-0.5; 63 7.5,0; 64 7.5,0.5; 65 7.5,1; 66 7.5,1.5; 67 7.5,2; 68 7.5,2.5; 69 7.5,3; 70 7.5,3.5; 71 7.5,4; 72 7.5,4.5; 73 7.5,5; 74 7.5,5.5; 75 7.5,6 | smd 0.3 x 1.5: 26 -6,-7.5; 27 -5.5,-7.5; 28 -5,-7.5; 29 -4.5,-7.5; 30 -4,-7.5; 31 -3.5,-7.5; 32 -3,-7.5; 33 -2.5,-7.5; 34 -2,-7.5; 35 -1.5,-7.5; 36 -1,-7.5; 37 -0.5,-7.5; 38 0,-7.5; 39 0.5,-7.5; 40 1,-7.5; 41 1.5,-7.5; 42 2,-7.5; 43 2.5,-7.5; 44 3,-7.5; 45 3.5,-7.5; 46 4,-7.5; 47 4.5,-7.5; 48 5,-7.5; 49 5.5,-7.5; 50 6,-7.5; 76 6,7.5; 77 5.5,7.5; 78 5,7.5; 79 4.5,7.5; 80 4,7.5; 81 3.5,7.5; 82 3,7.5; 83 2.5,7.5; 84 2,7.5; 85 1.5,7.5; 86 1,7.5; 87 0.5,7.5; 88 0,7.5; 89 -0.5,7.5; 90 -1,7.5; 91 -1.5,7.5; 92 -2,7.5; 93 -2.5,7.5; 94 -3,7.5; 95 -3.5,7.5; 96 -4,7.5; 97 -4.5,7.5; 98 -5,7.5; 99 -5.5,7.5; 100 -6,7.5
DDC_R-PDSO-G5 = smd 0.6 x 0.8: 1 -0.95,-1.25; 2 0,-1.25; 3 0.95,-1.25; 4 0.95,1.25; 5 -0.95,1.25
TSOP32 = smd 1 x 0.3: 1 -6.7,3.7; 2 -6.7,3.2; 3 -6.7,2.7; 4 -6.7,2.2; 5 -6.7,1.7; 6 -6.7,1.2; 7 -6.7,0.7; 8 -6.7,0.2; 9 -6.7,-0.3; 10 -6.7,-0.8; 11 -6.7,-1.3; 12 -6.7,-1.8; 13 -6.7,-2.3; 14 -6.7,-2.8; 15 -6.7,-3.3; 16 -6.7,-3.8; 17 6.6,-3.8; 18 6.6,-3.3; 19 6.6,-2.8; 20 6.6,-2.3; 21 6.6,-1.8; 22 6.6,-1.3; 23 6.6,-0.8; 24 6.6,-0.3; 25 6.6,0.2; 26 6.6,0.7; 27 6.6,1.2; 28 6.6,1.7; 29 6.6,2.2; 30 6.6,2.7; 31 6.6,3.2; 32 6.6,3.7
1X06_SMD = smd 1.27 x 1.27: GND 3.81,0; TCK 1.27,0; TDI -3.81,0; TDO -1.27,0; TMS -6.35,0; VCC 6.35,0
CRYSTAL-SMD-5X3 = smd 2 x 1.2: 1 -1.9,-1.2; 2 1.9,-1.2; 3 1.9,1.2; 4 -1.9,1.2
R0603 = smd 1 x 1.1: 1 -0.85,0; 2 0.85,0
SJ = smd 1.168 x 1.6: 1 -0.762,0; 2 0.762,0
TP12SQ = smd 1.2 x 1.2: TP 0,0
SDIP-64-CONN = drill 0.711 square: 1 -27.559,-9.525 | drill 0.711 round: 2 -25.781,-9.525; 3 -24.003,-9.525; 4 -22.225,-9.525; 5 -20.447,-9.525; 6 -18.669,-9.525; 7 -16.891,-9.525; 8 -15.113,-9.525; 9 -13.335,-9.525; 10 -11.557,-9.525; 11 -9.779,-9.525; 12 -8.001,-9.525; 13 -6.223,-9.525; 14 -4.445,-9.525; 15 -2.667,-9.525; 16 -0.889,-9.525; 17 0.889,-9.525; 18 2.667,-9.525; 19 4.445,-9.525; 20 6.223,-9.525; 21 8.001,-9.525; 22 9.779,-9.525; 23 11.557,-9.525; 24 13.335,-9.525; 25 15.113,-9.525; 26 16.891,-9.525; 27 18.669,-9.525; 28 20.447,-9.525; 29 22.225,-9.525; 30 24.003,-9.525; 31 25.781,-9.525; 32 27.559,-9.525; 33 27.559,9.525; 34 25.781,9.525; 35 24.003,9.525; 36 22.225,9.525; 37 20.447,9.525; 38 18.669,9.525; 39 16.891,9.525; 40 15.113,9.525; 41 13.335,9.525; 42 11.557,9.525; 43 9.779,9.525; 44 8.001,9.525; 45 6.223,9.525; 46 4.445,9.525; 47 2.667,9.525; 48 0.889,9.525; 49 -0.889,9.525; 50 -2.667,9.525; 51 -4.445,9.525; 52 -6.223,9.525; 53 -8.001,9.525; 54 -9.779,9.525; 55 -11.557,9.525; 56 -13.335,9.525; 57 -15.113,9.525; 58 -16.891,9.525; 59 -18.669,9.525; 60 -20.447,9.525; 61 -22.225,9.525; 62 -24.003,9.525; 63 -25.781,9.525; 64 -27.559,9.525

### Placement (x,y rotation side)
C1  84.3,4 180 top
C2  66.75,2.6 0 top
C3  81.4,2.6 270 top
C50  33.35,16.95 270 bottom
C52  68.35,5.65 180 bottom
C53  76.3,10.85 270 bottom
C54  74.9,10.85 270 bottom
C55  73.4,10.85 270 bottom
C56  72,10.85 270 bottom
C57  70.3,11.2 270 bottom
C58  68.9,11.2 270 bottom
C59  65.9,11.2 0 bottom
C60  16.75,11.2 90 bottom
C61  9,11.2 90 bottom
C62  65.9,12.65 0 bottom
C63  75.6,15.6 180 bottom
C64  75.6,17.05 180 bottom
C66  73.6,19.4 90 bottom
C67  72.2,19.4 90 bottom
C68  70.6,19.4 90 bottom
C69  69.2,19.4 90 bottom
C70  67.5,20 90 bottom
C71  66.1,20 90 bottom
C74  3.1,21.55 90 bottom
C75  1.7,21.55 90 bottom
C76  85.1,25.35 0 bottom
C77  85.1,26.8 0 bottom
IC1  76.95,26.6 0 top
IC2  79.75,26.6 0 top
IC3  71.35,26.5 0 top
IC4  74.15,26.5 0 top
IC5  68.3,26.2 0 top
IC6  82.9,23.95 270 top
IC7  82.9,21.15 270 top
IC8  82.9,18.35 270 top
IC9  30.7,17.05 0 top
IC10  82.9,15.55 270 top
IC11  71.35,15.1 180 top
IC12  82.9,12.75 270 top
IC13  82.9,9.95 270 top
IC14  82.9,7.15 270 top
IC15  70.1,3 180 top
IC16  72.9,3 180 top
IC17  75.7,3 180 top
IC18  78.55,3 180 top
IC19  83.9,1.75 270 top
IC20  25.25,15.75 0 bottom
JP50  78.85,14.55 270 bottom
Q50  12.89,11.22 0 bottom
R50  76.2,21.75 0 bottom
SJ1  10.2,2 90 top
SJ2  8,2 90 top
SJ3  5.8,2 90 top
TP_GND  1,24.85 0 top
TP_VCC  1,26.6 0 top
U1  30.7,14.4 0 top

### Tracks (layer width: path | path; a pad name or v marks a point on that pad's centre or on a via)
!D_HALT
  Bottom 0.178: U1.51 IC9.51
!D_INIT  (via drill 0.33)
  Top 0.178: IC11.81 67.85,6.55 66.05,4.75 63.35,4.75 56.1,12 49.35,12 49.1,11.75 32.05,11.75 31.3,12.5 26.7,12.5 v26.45,12.25
  Bottom 0.178: IC9.52 25.35,25.7 25.35,23.3 26.8,21.85 26.8,20.2 26.45,19.85 v26.45,12.25
!D_IRL
  Top 0.178: U1.5 IC9.5
!D_IRP  (via drill 0.33)
  Top 0.178: U1.4 IC9.4 | IC11.55 61.4,19.1 59.45,21.05 36.65,21.05 35.45,19.85 23.95,19.85 23.45,20.35 14,20.35 6.7,13.05 6.7,8.9 v7,8.6
  Bottom 0.178: IC9.4 8.45,7.55 7.4,8.6 v7,8.6
!D_NMI
  Top 0.178: U1.3 IC9.3
!D_RD  (via drill 0.33)
  Top 0.178: IC11.83 68.85,6.7 66.55,4.4 63.2,4.4 55.95,11.65 49.5,11.65 49.25,11.4 31.9,11.4 31.15,12.15 29.55,12.15 28.35,10.95 19.45,10.95 v19.2,11.2
  Bottom 0.178: IC9.10 19.2,7.58 v19.2,11.2
!D_TEST
  Bottom 0.178: U1.49 IC9.49
!D_WDC
  Top 0.178: U1.53 IC9.53
!D_WI
  Bottom 0.178: U1.50 IC9.50
!D_WR  (via drill 0.33)
  Top 0.178: IC11.89 71.85,6.8 71.3,6.25 v71.3,6.3
  Bottom 0.178: v71.3,6.3 71.15,6.45 66.9,6.45 65.75,5.3 61.3,5.3 59.4,3.4 51.35,3.4 50.25,4.5 50.25,5.15 49.7,5.7 48.65,5.7 47.65,6.7 21.75,6.7 IC9.11
!E_INIT  (via drill 0.33)
  Top 0.178: IC11.98 76.35,8.45 74.35,10.45 70.35,10.45 69.2,9.3 v69.2,8.85 | U1.52 25.3,24.75 44.75,24.75 v44.95,24.55
  Bottom 0.178: v69.2,8.85 67.9,7.55 66.45,7.55 65.6,6.7 50.8,6.7 50.25,7.25 50.25,8.9 50.6,9.25 50.6,15.9 44.95,21.55 v44.95,24.55
!E_IS  (via drill 0.33)
  Top 0.178: IC11.54 61.4,19.6 59.6,21.4 36.5,21.4 35.3,20.2 25.65,20.2 v25.4,20.45 | v18.6,9.45 19.05,9.9 23.85,9.9 v24.1,9.65
  Bottom 0.178: U1.10 19.14,5.66 18.25,6.55 18.25,9.1 v18.6,9.45 | v25.4,20.45 25.1,20.45 24.5,19.85 24.5,10.05 v24.1,9.65
!E_OS  (via drill 0.33)
  Top 0.178: IC11.65 63,14.1 62.9,14.2 60.4,14.2 57.55,17.05 26.45,17.05 v25.45,16.05 | v20,9.3 20.25,9.05 24.85,9.05 v25.45,9.65
  Bottom 0.178: v25.45,9.65 v25.45,16.05 | v20,9.3 20,6.55 20.92,5.63 U1.11
!M_RD  (via drill 0.33)
  Top 0.178: IC11.14 77.8,15.6 77.3,16.1 v73.1,16.1 | v56.8,8.57 55.93,8.57 53.55,10.95 49.8,10.95 49.55,10.7 31.6,10.7 31.1,11.2 30.3,11.2 29.7,10.6 18.9,10.6 v18.3,11.2 | v68.7,16.7 68.15,16.15 68.15,11.9 65.2,8.95 65.2,8.7 v64.6,8.1
  Bottom 0.178: v56.8,8.57 56.77,8.6 59,8.6 59.85,7.75 64.25,7.75 v64.6,8.1 | v73.1,16.1 69.3,16.1 v68.7,16.7 | IC20.32 17.85,19.45 16.1,17.7 16.1,14.5 17.8,12.8 17.8,11.7 v18.3,11.2
!M_ROM_CS  (via drill 0.33)
  Top 0.178: IC11.78 66.35,6.55 65.6,5.8 63.8,5.8 56.55,13.05 48.9,13.05 48.65,12.8 34.5,12.8 34,13.3 33.1,13.3 32.65,12.85 17.25,12.85 16.7,13.4 v16.7,15.2
  Bottom 0.178: IC20.30 17.35,18.45 16.7,17.8 v16.7,15.2
!M_WR/M_A15  (via drill 0.33)
  Top 0.178: IC11.19 77.9,18.1 77.8,18.2 73.55,18.2 v72.25,16.9 | v59.35,7.4 59.35,7.7 55.75,11.3 49.65,11.3 49.4,11.05 31.75,11.05 31.25,11.55 v29.8,11.55 | v66.1,8.85 66.1,9.35 68.5,11.75 68.5,15.65 v69.55,16.7
  Bottom 0.178: v72.25,16.9 72.05,16.7 v69.55,16.7 | v66.1,8.85 66.1,8.65 64.85,7.4 v59.35,7.4 | IC20.7 31.2,16.45 31.05,16.6 30.5,16.6 29.8,15.9 v29.8,11.55
C_DRA0
  Top 0.178: IC11.30 75.35,23.55 75.7,23.9 75.7,26.1 76.4,26.8 76.75,26.8 76.95,27 IC1.5
C_DRA1
  Top 0.178: IC4.5 74.15,26.9 74.35,26.7 74.7,26.7 75.3,26.1 75.3,24.05 74.85,23.6 IC11.31
C_DRA2
  Top 0.178: IC3.5 71.35,26.9 71.95,26.3 72.3,26.3 72.65,25.95 72.65,24.2 73.2,23.65 73.6,23.65 73.85,23.4 IC11.33
C_DRA3
  Top 0.178: IC11.40 70.35,23.45 70,23.8 70,25.25 69,26.25 68.65,26.25 68.3,26.6 IC5.5
C_DRA4
  Top 0.178: IC15.5 70.1,2.6 70.3,2.8 70.7,2.8 71.25,3.35 71.25,5.45 70.25,6.45 70.15,6.45 69.85,6.75 IC11.85
C_DRA5
  Top 0.178: IC16.5 72.9,2.6 73.1,2.8 73.8,2.8 74.3,3.3 74.3,5.95 73.85,6.4 IC11.93
C_DRA6
  Top 0.178: IC17.5 75.7,2.6 75.9,2.8 76.6,2.8 77,3.2 77,5.8 76.25,6.55 75.55,6.55 75.35,6.75 IC11.96
C_DRA7
  Top 0.178: IC18.5 78.55,2.6 78.75,2.8 79.4,2.8 79.7,3.1 79.7,5 79.85,5.15 79.85,5.8 79.45,6.2 77.95,6.2 77.35,6.8 IC11.100
C_DRB0
  Top 0.178: IC11.28 76.35,23.45 76.55,23.65 77.75,23.65 78.5,24.4 78.5,26.1 79.2,26.8 79.55,26.8 79.75,27 IC2.5
C_DRB1
  Top 0.178: IC11.24 79.65,20.6 80.4,21.35 80.4,22.4 80.8,22.8 82.5,22.8 83.1,23.4 83.1,23.75 83.3,23.95 IC6.5
C_DRB2
  Top 0.178: IC11.20 79.7,18.6 80.4,19.3 80.4,19.55 80.85,20 82.5,20 83.1,20.6 83.1,20.95 83.3,21.15 IC7.5
C_DRB3
  Top 0.178: IC11.16 79.7,16.6 80.3,17.2 82.5,17.2 83.1,17.8 83.1,18.15 83.3,18.35 IC8.5
C_DRB4
  Top 0.178: IC11.10 79.65,13.6 80.55,14.5 81.4,14.5 81.5,14.4 82.5,14.4 83.1,15 83.1,15.35 83.3,15.55 IC10.5
C_DRB5
  Top 0.178: IC11.8 79.65,12.6 80.1,13.05 80.1,13.5 80.7,14.1 81.3,14.1 81.5,13.9 82.5,13.9 83.1,13.3 83.1,12.95 83.3,12.75 IC12.5
C_DRB6
  Top 0.178: IC11.6 79.65,11.6 79.8,11.45 82.15,11.45 83.1,10.5 83.1,10.15 83.3,9.95 IC13.5
C_DRB7
  Top 0.178: IC14.5 83.3,7.15 83.1,7.35 83.1,7.7 82.45,8.35 81.05,8.35 79.8,9.6 IC11.2
C_PA0
  Top 0.178: IC1.3 77.85,25.7 78.1,25.45 78.1,24.65 77.5,24.05 76.4,24.05 75.85,23.5 IC11.29
C_PA1
  Top 0.178: IC11.32 74.35,23.65 74.9,24.2 74.9,24.85 74.8,24.95 IC4.3
C_PA2
  Top 0.178: IC3.3 72,24.95 72.25,24.7 72.25,24.05 72.85,23.45 IC11.35
C_PA3
  Top 0.178: IC5.3 69.25,25.3 69.6,24.95 69.6,23.65 69.85,23.4 IC11.41
C_PA4
  Top 0.178: IC15.3 69.45,4.35 69.35,4.45 IC11.84
C_PA5
  Top 0.178: 73.35,7.8 IC11.92 73.35,6.3 72.25,5.2 IC16.3
C_PA6
  Top 0.178: 74.35,7.75 IC11.94 74.35,6.45 74.7,6.1 74.7,4.7 75.05,4.35 IC17.3
C_PA7
  Top 0.178: IC11.99 76.85,6.75 77.4,6.2 77.4,4.85 77.9,4.35 IC18.3
C_PB0
  Top 0.178: IC2.3 80.4,24.4 79.4,23.4 77.55,21.55 77.5,21.5 77.1,21.5 76.85,21.75 IC11.27
C_PB1
  Top 0.178: 78.85,21.4 | 78.85,21.4 79,21.55 79.45,21.55 79.95,22.05 79.95,22.5 80.75,23.3 IC6.3 | IC11.25 78.85,21.4
C_PB2
  Top 0.178: IC7.3 80.8,20.5 80,19.7 80,19.45 79.65,19.1 IC11.21
C_PB3
  Top 0.178: IC11.17 79.65,17.1 80.25,17.7 IC8.3
C_PB4
  Top 0.178: IC10.3 79.95,14.9 79.65,14.6 IC11.12
C_PB5
  Top 0.178: IC11.7 79.7,12.1 79.95,11.85 81.3,11.85 81.55,12.1 IC12.3
C_PB6
  Top 0.178: IC13.3 81.55,9.3 81.45,9.2 80.75,9.2 79.9,10.05 79.9,10.85 79.65,11.1 IC11.5
C_PB7
  Top 0.178: IC14.3 80.75,6.5 79.9,7.35 79.9,8.25 80.05,8.4 80.05,8.8 79.75,9.1 IC11.1
D1_XIN
  Bottom 0.305: IC9.6 12.03,8.73 12.55,9.25 12.55,12.05 12.18,12.42 Q50.3 9.37,12.42 C61.2
D1_XOUT
  Bottom 0.305: IC9.7 13.81,8.69 13.25,9.25 13.25,9.75 13.52,10.02 Q50.1 16.42,10.02 C60.1
D_A8  (via drill 0.33)
  Top 0.178: IC11.49 65.85,25.05 62.8,28.1 54.45,28.1 IC9.36 51.6,27.9 27.75,27.9 v27.15,27.3
  Bottom 0.178: IC20.3 31,18.45 28.55,20.9 28.55,21.9 27.15,23.3 v27.15,27.3
D_A9  (via drill 0.33)
  Top 0.178: IC11.50 65.35,25 62.6,27.75 55.88,27.75 IC9.35 53.88,25.75 52.55,25.75 52.05,26.25 52.05,26.85 51.4,27.5 29.1,27.5 v28.9,27.3
  Bottom 0.178: IC20.2 31,18.95 28.9,21.05 v28.9,27.3
D_A10  (via drill 0.33)
  Top 0.178: IC11.37 71.85,21.45 v71.7,21.3 | v64.6,22.85 64.6,25.2 62.4,27.4 57.31,27.4 IC9.34 54.66,24.75 54.2,24.75 53.85,24.4 53.85,23.5 53.15,22.8 v23.6,22.8
  Bottom 0.178: v71.7,21.3 70.4,22.6 64.85,22.6 v64.6,22.85 | IC20.31 19.75,18.95 v23.6,22.8
D_A11  (via drill 0.33)
  Top 0.178: IC11.36 72.35,21.6 v72.65,21.3 | v63.75,23.25 63.75,25.5 62.2,27.05 58.73,27.05 IC9.33 56.43,24.75 55.95,24.75 55.6,24.4 55.6,23.5 54.55,22.45 35.7,22.45 v34.75,21.5
  Bottom 0.178: v72.65,21.3 70.95,23 65.45,23 64.95,23.5 64,23.5 v63.75,23.25 | IC20.1 32.7,19.45 v34.75,21.5
D_A12  (via drill 0.33)
  Top 0.178: IC11.45 67.85,16.45 67.8,16.4 67.8,12.05 64.85,9.1 64.85,8.85 64.7,8.7 64.15,8.7 v63.85,8.4 | IC9.31 56.48,7.55 53.43,10.6 49.95,10.6 49.7,10.35 31.1,10.35 v30.85,10.6
  Bottom 0.178: v63.85,8.4 63.7,8.25 59.9,8.25 59,9.15 56.55,9.15 56.15,8.75 56.15,7.85 IC9.31 | v30.85,10.6 30.85,13.6 31.2,13.95 IC20.12
D_A13  (via drill 0.33)
  Top 0.178: IC11.46 67.35,15.5 v67.15,15.3 | IC9.30 54.7,7.55 52.35,9.9 50.25,9.9 50,9.65 29.25,9.65 29,9.9 27.9,9.9 v27.65,9.65
  Bottom 0.178: v67.15,15.3 66.85,15 65,15 63.8,13.8 63.8,9.35 63.05,8.6 60.1,8.6 59.2,9.5 56.4,9.5 54.7,7.8 IC9.30 | v27.65,9.65 27.65,14.75 30.85,17.95 IC20.4
D_A14  (via drill 0.33)
  Top 0.178: v66.75,16 66.85,16.1 IC11.47 | IC9.29 52.93,7.55 52.9,7.55 51.25,9.2 50.55,9.2 50.3,8.95 v28.55,8.95
  Bottom 0.178: v66.75,16 66.15,15.4 64.9,15.4 63.4,13.9 63.4,9.45 62.9,8.95 60.35,8.95 59.45,9.85 56.25,9.85 54.75,8.35 53.75,8.35 IC9.29 | v28.55,8.95 28.55,15.15 30.85,17.45 IC20.5
D_A15  (via drill 0.33)
  Top 0.178: IC11.48 66.35,16.5 v65.85,16
  Bottom 0.178: v65.85,16 65,16 63,14 63,9.6 62.7,9.3 60.5,9.3 59.6,10.2 56.1,10.2 54.6,8.7 52.32,8.7 IC9.28
D_ADR  (via drill 0.33)
  Top 0.178: U1.9 IC9.9 | IC11.90 72.35,6.4 v72.25,6.3 | v59.5,4.8 58.75,4.05 57.9,4.05 57.4,4.55 57.4,5.15 55.6,6.95 55.6,7.95 53.3,10.25 50.1,10.25 49.85,10 29.45,10 29.2,10.25 v18.35,10.25
  Bottom 0.178: IC9.9 17.35,7.54 17.35,9.25 v18.35,10.25 | v72.25,6.3 71.55,7 71.05,7 70.9,6.85 66.8,6.85 65.6,5.65 60.35,5.65 v59.5,4.8
D_AL0  (via drill 0.33)
  Top 0.178: IC11.64 60.5,14.6 57.7,17.4 23.7,17.4 v22.3,16
  Bottom 0.178: IC20.20 20.6,13.45 22.3,15.15 v22.3,16
D_AL1  (via drill 0.33)
  Top 0.178: IC11.63 60.5,15.1 57.85,17.75 23.15,17.75 v22.6,17.2
  Bottom 0.178: IC20.19 20.6,12.95 22.9,15.25 22.9,16.25 22.6,16.55 v22.6,17.2
D_AL2  (via drill 0.33)
  Top 0.178: v68.7,21.3 68.35,21.65 IC11.44 | v58.4,22.15 58,21.75 36.35,21.75 35.15,20.55 26.2,20.55 25.7,21.05 v24.3,21.05
  Bottom 0.178: v68.7,21.3 68.2,21.8 63.75,21.8 63,22.55 58.8,22.55 v58.4,22.15 | IC20.18 21.4,12.45 23.8,14.85 23.8,20.55 v24.3,21.05
D_AL3  (via drill 0.33)
  Top 0.178: IC11.42 69.35,21.75 v69.8,21.3 | v57.55,22.35 57.3,22.1 36.2,22.1 35,20.9 26.7,20.9 v26.2,21.4
  Bottom 0.178: v69.8,21.3 68.9,22.2 63.9,22.2 63.15,22.95 58.15,22.95 v57.55,22.35 | IC20.17 21.4,11.95 24.15,14.7 24.15,20.05 25.5,21.4 v26.2,21.4
D_AL4  (via drill 0.33)
  Top 0.178: IC11.79 66.85,6.55 65.75,5.45 63.65,5.45 56.4,12.7 49.05,12.7 48.8,12.45 34,12.45 v33.75,12.7
  Bottom 0.178: IC20.16 31.95,11.65 32.2,11.4 32.9,11.4 33.75,12.25 v33.75,12.7
D_AL5  (via drill 0.33)
  Top 0.178: IC11.80 67.35,6.55 65.9,5.1 63.5,5.1 56.25,12.35 49.2,12.35 48.95,12.1 33.25,12.1 v33,12.35
  Bottom 0.178: IC20.15 32.9,12.45 v33,12.35
D_AL6  (via drill 0.33)
  Top 0.178: IC11.57 61.4,18.1 59.15,20.35 37.85,20.35 v37.6,20.1
  Bottom 0.178: IC20.14 33.15,12.95 33.5,13.3 35.4,13.3 37.2,15.1 37.2,19.7 v37.6,20.1
D_AL7  (via drill 0.33)
  Top 0.178: IC11.56 61.4,18.6 59.3,20.7 37.1,20.7 v36.85,20.45
  Bottom 0.178: IC20.13 33.15,13.45 33.4,13.7 35.3,13.7 36.85,15.25 v36.85,20.45
D_ASR0
  Top 0.178: U1.2 IC9.2
D_ASR1
  Top 0.178: U1.1 IC9.1
D_ASR2
  Top 0.178: U1.63 IC9.63
D_ASR3
  Top 0.178: U1.62 IC9.62
D_CCLK  (via drill 0.33)
  Top 0.178: U1.8 IC9.8 | IC11.87 70.85,8.4 71.05,8.6 v71.05,9.3 | v55.6,5.45 53.8,7.25 53.8,7.95 52.2,9.55 50.4,9.55 50.15,9.3 29.05,9.3 28.8,9.55 28.35,9.55 27.25,8.45 v16.75,8.45
  Bottom 0.178: v71.05,9.3 70.9,9.45 70.15,9.45 69.8,9.1 69.8,8.6 68.4,7.2 66.65,7.2 65.45,6 56.15,6 v55.6,5.45 | IC9.8 15.58,7.53 16.3,8.25 16.5,8.45 v16.75,8.45
D_DA0  (via drill 0.33)
  Top 0.178: IC11.75 62,9.1 57,14.1 49.65,14.1 v49.4,14.35 49.15,14.6 46.55,14.6 45.8,13.85 34.95,13.85 34.45,14.35 32.65,14.35 32.2,13.9 20.2,13.9 v19.95,14.15 | IC11.75 63.95,9.1 64,9.15 63.9,9.15 IC11.75
  Bottom 0.178: 49.35,7.54 IC9.27 49.4,7.56 v49.4,14.35 | IC20.21 19.75,13.95 v19.95,14.15
D_DA1  (via drill 0.33)
  Top 0.178: IC11.76 65.35,6.7 65.15,6.5 64.1,6.5 56.85,13.75 48.3,13.75 v48.05,14 46.45,14 45.95,13.5 34.8,13.5 34.3,14 32.8,14 32.35,13.55 17.9,13.55 v17.65,13.8
  Bottom 0.178: IC9.26 48.05,8 v48.05,14 | IC20.22 17.95,14.45 17.65,14.15 v17.65,13.8
D_DA2  (via drill 0.33)
  Top 0.178: IC11.77 65.85,6.55 65.45,6.15 63.95,6.15 56.7,13.4 v46.7,13.4 46.45,13.15 34.65,13.15 34.15,13.65 32.95,13.65 32.5,13.2 17.4,13.2 17.05,13.55 17.05,14.4 v17.35,14.7
  Bottom 0.178: IC9.25 46.7,8.41 v46.7,13.4 | v17.35,14.7 17.6,14.95 IC20.23
D_DA3  (via drill 0.33)
  Top 0.178: IC11.60 61.9,16.6 58.85,19.65 44.35,19.65 v44.1,19.4 43.85,19.65 39.25,19.65 38.75,19.15 23.65,19.15 23.15,19.65 22.05,19.65 20,17.6 v17.6,17.6
  Bottom 0.178: IC9.24 45.1,8.59 45.1,18.4 v44.1,19.4 | IC20.25 17.95,15.95 17.6,16.3 v17.6,17.6
D_DA4  (via drill 0.33)
  Top 0.178: IC11.72 61,10.6 56.65,14.95 44.05,14.95 v43.55,14.45 43.3,14.2 35.1,14.2 34.6,14.7 32.5,14.7 32.05,14.25 21,14.25 v20.75,14.5
  Bottom 0.178: IC9.23 43.55,8.82 v43.55,14.45 | IC20.26 19.5,16.45 20.75,15.2 v20.75,14.5
D_DA5  (via drill 0.33)
  Top 0.178: IC11.71 61,11.1 56.8,15.3 42.65,15.3 v42.15,14.8 41.9,14.55 35.25,14.55 34.75,15.05 v21.4,15.05
  Bottom 0.178: IC9.22 42.15,9.2 v42.15,14.8 | IC20.27 19.5,16.95 v21.4,15.05
D_DA6  (via drill 0.33)
  Top 0.178: IC11.61 60,16.1 58,18.1 40.05,18.1 v39.8,18.35 39.55,18.1 22.85,18.1 v22.6,18.35
  Bottom 0.178: IC9.21 39.8,8.63 v39.8,18.35 | IC20.28 19.85,17.45 20.75,18.35 v22.6,18.35
D_DA7  (via drill 0.33)
  Top 0.178: IC11.58 61.4,17.6 59,20 38.7,20 v38.45,19.75 38.2,19.5 23.8,19.5 23.3,20 21.55,20 v19.85,18.3
  Bottom 0.178: IC9.20 36.9,7.55 38.7,9.35 38.7,19.5 v38.45,19.75 | IC20.29 19.5,17.95 v19.85,18.3
D_DOUT0
  Top 0.178: U1.61 IC9.61
D_DOUT1
  Top 0.178: U1.60 IC9.60
D_DOUT2
  Top 0.178: U1.59 IC9.59
D_DOUT3
  Top 0.178: U1.58 IC9.58
D_DOUT4
  Top 0.178: U1.57 IC9.57
D_DOUT5
  Top 0.178: U1.56 IC9.56
D_DOUT6
  Top 0.178: U1.55 IC9.55
D_DOUT7
  Top 0.178: U1.54 IC9.54
D_PA0  (via drill 0.33)
  Top 0.178: IC1.4 77.6,27.95 77,28.55 66.4,28.55 65.3,27.45 v65.3,26.55
  Bottom 0.178: U1.36 54.7,25.7 64.45,25.7 v65.3,26.55
D_PA1  (via drill 0.33)
  Top 0.178: IC4.4 74.8,27.85 74.5,28.15 66.55,28.15 66,27.6 v66,25.9
  Bottom 0.178: U1.35 56.08,25.3 65.4,25.3 v66,25.9
D_PA2  (via drill 0.33)
  Top 0.178: IC3.4 72,26.9 72.2,26.7 72.8,26.7 v73,26.5
  Bottom 0.178: U1.34 57.46,24.9 67.3,24.9 69.25,26.85 72.65,26.85 v73,26.5
D_PA3  (via drill 0.33)
  Top 0.178: IC5.4 69.3,27.1 69.6,26.8 69.6,26.55 v69.95,26.2
  Bottom 0.178: U1.33 58.83,24.5 67.45,24.5 69.15,26.2 v69.95,26.2
D_PA4
  Top 0.178: IC15.4 69.45,2.6 69.25,2.8 69,2.8 68.4,3.4 66.95,3.4 66.75,3.2 66.75,2 66.5,1.75 59.65,1.75 56.52,4.88 U1.31
D_PA5
  Top 0.178: U1.30 54.73,4.87 55.6,4 56.9,4 59.5,1.4 72,1.4 72.25,1.65 IC16.4
D_PA6
  Top 0.178: U1.29 54.15,3.65 56.75,3.65 59.35,1.05 74.45,1.05 75.05,1.65 IC17.4
D_PA7
  Top 0.178: U1.28 52.72,3.3 56.6,3.3 59.2,0.7 76.95,0.7 77.9,1.65 IC18.4
D_PB0  (via drill 0.33)
  Top 0.178: IC2.4 80.4,28 80.75,28.35 v81.85,28.35 | v83.25,27.6 84.75,26.1 v84.75,23.9
  Bottom 0.178: v84.75,23.9 83.8,22.95 83.8,13.9 83.4,13.5 83.4,12 83.6,11.8 83.6,8.5 82.7,7.6 82.7,4.75 82.05,4.1 81.05,4.1 80.75,4.4 70.3,4.4 70.25,4.35 67.4,4.35 66.1,3.05 51.15,3.05 49.38,4.82 49.38,4.87 U1.27 | v83.25,27.6 82.5,28.35 v81.85,28.35
D_PB1  (via drill 0.33)
  Top 0.178: v84.75,22.95 84.4,23.3 IC6.4
  Bottom 0.178: U1.26 47.59,4.66 49.55,2.7 66.3,2.7 67.55,3.95 70.35,3.95 70.4,4 80.6,4 80.9,3.7 82.2,3.7 83.1,4.6 83.1,7.45 84,8.35 84,11.95 83.8,12.15 83.8,13.35 84.2,13.75 84.2,22.4 v84.75,22.95
D_PB2  (via drill 0.33)
  Top 0.178: v84.85,20.15 84.5,20.5 IC7.4
  Bottom 0.178: U1.25 48.34,2.35 66.5,2.35 67.7,3.55 70.45,3.55 70.5,3.6 80.45,3.6 80.75,3.3 82.35,3.3 83.5,4.45 83.5,7.3 84.4,8.2 84.4,12.1 84.2,12.3 84.2,13.2 84.6,13.6 84.6,19.9 v84.85,20.15
D_PB3  (via drill 0.33)
  Top 0.178: v85.25,17.35 84.9,17.7 IC8.4
  Bottom 0.178: U1.24 46.91,2 66.7,2 67.85,3.15 70.55,3.15 70.6,3.2 80.3,3.2 80.6,2.9 82.5,2.9 83.9,4.3 83.9,7.15 84.8,8.05 84.8,12.25 84.6,12.45 84.6,13.05 85,13.45 85,17.1 v85.25,17.35
D_PB4  (via drill 0.33)
  Top 0.178: v85.65,14.45 85.2,14.9 IC10.4
  Bottom 0.178: U1.23 45.48,1.65 66.9,1.65 68,2.75 70.65,2.75 70.7,2.8 80.15,2.8 80.45,2.5 82.65,2.5 84.3,4.15 84.3,7 85.2,7.9 85.2,12.4 85,12.6 85,12.9 85.65,13.55 v85.65,14.45
D_PB5  (via drill 0.33)
  Top 0.178: v85.75,12.75 85.1,12.1 IC12.4
  Bottom 0.178: U1.22 44.05,1.3 82,1.3 84.7,4 84.7,6.85 85.6,7.75 85.6,12.6 v85.75,12.75
D_PB6  (via drill 0.33)
  Top 0.178: IC13.4 84.3,9.3 85.75,7.85 v85.75,6.95
  Bottom 0.178: U1.21 42.63,0.95 82.2,0.95 85.1,3.85 85.1,6.3 v85.75,6.95
D_PB7  (via drill 0.33)
  Top 0.178: v85.75,5.6 85.15,5.6 84.25,6.5 IC14.4
  Bottom 0.178: U1.20 41.2,0.6 82.4,0.6 85.75,3.95 v85.75,5.6
D_PC0
  Bottom 0.178: U1.48 IC9.48
D_PC1
  Bottom 0.178: U1.47 IC9.47
D_PC2
  Bottom 0.178: U1.46 IC9.46
D_PC3
  Bottom 0.178: U1.45 IC9.45
D_PC4
  Bottom 0.178: U1.44 IC9.44
D_PC5
  Bottom 0.178: U1.43 IC9.43
D_PC6
  Bottom 0.178: U1.42 IC9.42
D_PC7
  Bottom 0.178: U1.41 IC9.41
D_PD0
  Bottom 0.178: U1.40 IC9.40
D_PD1
  Bottom 0.178: U1.39 IC9.39
D_PD2
  Bottom 0.178: U1.38 IC9.38
D_PD3
  Bottom 0.178: U1.37 IC9.37
D_SCLK
  Top 0.178: U1.13 IC9.13
  Bottom 0.178: U1.13
D_SIN0
  Top 0.178: U1.17 IC9.17
D_SIN1
  Top 0.178: U1.16 IC9.16
D_SIN2
  Top 0.178: U1.15 IC9.15
D_SIN3
  Top 0.178: U1.14 IC9.14
D_SOUT0
  Top 0.178: U1.19 IC9.19
D_SOUT1
  Top 0.178: U1.18 IC9.18
GND  (via drill 0.33)
  Top 0.178: v73,5.05 73,4.45 72.9,4.35 IC16.2 | 75.5,5 75.5,4.55 75.7,4.35 IC17.2 | v78.35,5.05 78.35,4.55 78.55,4.35 IC18.2 | v81.1,9.85 81.2,9.95 IC13.2 | v81.05,12.5 81.3,12.75 IC12.2 | v81.05,18.35 IC8.2 | v81.05,21.15 IC7.2 | v81.05,15.55 IC10.2 | v81.05,23.95 IC6.2 | IC11.11 78.05,14.1 77.75,13.8 77.75,13.45 77.45,13.15 75.9,13.15 v75.45,13.6 | IC15.2 70.1,3.4 69.9,3.2 69.15,3.2 68.55,3.8 66.5,3.8 65.9,3.2 C2.1
  Top 0.305: v81.1,7.15 IC14.2 | 75.5,5 v75.5,5.05 75.5,5.95 74.85,6.6 IC11.95 74.85,8.6 v74.55,8.9 | IC3.2 71.35,24.35 v71.6,24.1 71.35,23.85 IC11.38 | v74.25,24.45 74.25,24.85 74.15,24.95 IC4.2 | v77.3,24.75 76.95,25.1 IC1.2 | v79.75,24.75 IC2.2 79.75,26.3 80,26.55 81,26.55 83,28.55 85.5,28.55 v85.95,28.1 86.45,27.6 86.45,2.1 v86.1,1.75 83.7,1.75 | IC11.59 64.8,17.1 v65.15,17.45 | 83.7,1.75 83.7,3.75 83.45,3.75 C1.2 | C3.2 IC19.2 83.7,1.75 | IC11.43 68.85,24.2 v68.7,24.35 68.3,24.75 IC5.2 68.3,25.8 67.8,26.3 v66.8,26.3 | v77.3,24.75 | v77.3,24.75 | IC11.26 77.75,22.6 v78.3,23.15 | v79.2,22.25 79.2,22.4 80.75,23.95 v81.05,23.95 | v81.05,23.95 | IC11.74 62.75,9.6 v62.4,9.95 | IC9.32 U1.32 58.93,5.55 60.1,5.55 v61.55,4.1 63.05,2.6 C2.1 | IC9.32 58.25,7.55 | v55.2,10.45 56,10.45 58.26,8.19 IC9.32 | IC11.86 70.35,8.8 v70.4,8.85 | v49.55,3.7 50.25,4.4 50.25,7.95 v50.9,8.6 | v17.35,15.7 17.2,15.85 14.15,15.85
  Bottom 0.178: v78.35,5.05 78.5,5.05 | v81.1,9.85 81.7,10.45 81.7,11.1 81.05,11.75 v81.05,12.5 81.7,13.15 81.7,13.75 81.05,14.4 v81.05,15.55 v81.05,18.35 81.7,19 81.7,19.6 81.05,20.25 v81.05,21.15 81.7,21.8 81.7,22.35 81.05,23 v81.05,23.95 | 75.45,5.05 v75.5,5.05
  Bottom 0.305: v75.5,5.05 75.7,4.85 78.15,4.85 v78.35,5.05 78.55,4.85 79.6,4.85 79.9,5.15 79.9,5.5 81.1,6.7 v81.1,7.15 81.25,7.3 81.25,9.7 v81.1,9.85 | 70,4.85 69.95,4.8 70,4.85 | 70,4.85 72.8,4.85 v73,5.05 73.2,4.85 75.25,4.85 75.45,5.05 | 70,4.85 | 74.25,24.55 73.65,25.15 | 73.65,25.15 | 73.65,25.15 72.65,25.15 v71.6,24.1 71.6,24.15 70.95,24.8 70.35,24.8 69.9,24.35 v68.7,24.35 | 71.07,8.18 71.6,7.65 73.3,7.65 v74.55,8.9 75.6,7.85 | 71.07,8.18 v70.4,8.85 | 70,4.85 70,4.8 67.5,4.8 | v81.05,23.95 81.25,23.95 81.85,24.55 81.85,25.2 81.3,25.75 80.75,25.75 v79.75,24.75 v77.3,24.75 77.3,24.9 76.75,25.45 76,25.45 | 76,25.45 | 74.25,24.55 75.1,24.55 76,25.45 | 76,25.45 | 74.25,24.55 v74.25,24.45 | v74.25,24.45 | v79.2,22.25 v78.3,23.15 | v62.4,9.95 61.4,10.95 55.7,10.95 v55.2,10.45 52.75,10.45 v50.9,8.6 | JP50.GND 79.85,9.74 79.85,7.65 79.4,7.2 76.25,7.2 75.6,7.85 | v85.95,28.1 C77.1 C76.1 | 67.5,4.8 67.2,4.8 66.3,3.9 61.73,3.9 61.73,3.92 v61.55,4.1 | v66.8,26.3 65.8,27.3 v64.6,27.3 59,27.3 58.85,27.45 31.1,27.45 30.7,27.05 30.7,22.35 35.15,22.35 35.55,21.95 35.55,21 33.35,18.8 C50.1 | 8.35,13.35 7.6,12.6 7.6,10.85 8.13,10.32 8.97,10.32 C61.1 | 67.5,4.8 C52.1 | v36.9,6.05 v38.85,6.05 40.6,6.05 v40.65,6 42.35,6 v42.4,6.05 44.2,6.05 v44.25,6 45.9,6 v45.95,5.95 47.8,5.95 48.5,5.25 48.5,4.45 49.25,3.7 v49.55,3.7 | v76.75,8.95 76.7,8.95 75.6,7.85 | 71.07,8.18 v71.8,8.9 | v65.15,17.45 64.1,16.4 | C74.1 C75.1 | IC20.24 17.6,15.45 v17.35,15.7
  Bottom 0.406: C63.1 C64.1 | C53.1 C54.1 C55.1 C56.1 | C58.1 C57.1 | C59.1 C62.1 | v65.15,17.45 66.1,18.4 C71.1 C70.1 | C69.1 C68.1 | C67.1 C66.1
  other vias: 81.1,25.9 80.4,26.6 6.35,27.8 8.35,27.8 10.35,27.8 12.35,27.8 14.35,27.8 16.35,27.8 18.35,27.8 20.35,27.8 22.35,27.8 24.35,27.8 26.35,27.8 85.35,21.8 85.35,18.8 84.35,27.8 75.6,20.5 76.5,20.5 77.4,20.5 71.85,13.6 72.75,13.6 73.65,13.6 74.55,13.6 73.45,15.3 72.55,15.3 71.65,15.3 70.75,15.45 73.5,17 77.4,19.65 76.5,19.65 19.85,15.1
  pour Top (isolate 0.152, rank 2): -1.45,30.15 87.8,30.15 87.85,-17.15 -1.45,-17.15
  pour Bottom (isolate 0.152, rank 2): -1.45,30.15 87.8,30.15 87.8,-17.15 -1.45,-17.15
M_A15  (via drill 0.33)
  Top 0.178: IC11.69 61,12.1 57.1,16 36.75,16 v36.25,15.5
  Bottom 0.178: IC20.11 35.2,14.45 v36.25,15.5
M_A16  (via drill 0.33)
  Top 0.178: IC11.68 61,12.6 57.25,16.35 36.1,16.35 v35.45,15.7
  Bottom 0.178: IC20.10 34.7,14.95 v35.45,15.7
M_A17/M_A14  (via drill 0.33)
  Top 0.178: IC11.67 63,13.1 62.9,13 61.1,13 57.4,16.7 34.8,16.7 v34.55,16.45
  Bottom 0.178: IC20.6 34.05,16.95 v34.55,16.45
MSEL0  (via drill 0.33)
  Top 0.178: IC11.52 62.95,20.6 62,21.55 v62,21.95 | v56.15,19.05 55.9,18.8 40.7,18.8 40.2,19.3 39.4,19.3 38.9,18.8 23.5,18.8 23,19.3 22.2,19.3 19.9,17 11.15,17 7.05,12.9 7.05,9.45 7.6,8.9 7.6,4.45 7,3.85 6.15,3.85 5.8,3.5 SJ3.2
  Bottom 0.178: v56.15,19.05 59.25,22.15 61.8,22.15 v62,21.95
MSEL1  (via drill 0.33)
  Top 0.178: IC11.53 62.7,20.1 v61.45,21.35 | v57,19.05 56.4,18.45 40.55,18.45 40.05,18.95 39.55,18.95 39.05,18.45 23.35,18.45 22.85,18.95 22.35,18.95 20.05,16.65 11.3,16.65 7.4,12.75 7.4,9.6 8.5,8.5 8.9,8.5 9.35,8.05 9.35,4.45 8.75,3.85 8.35,3.85 8,3.5 SJ2.2
  Bottom 0.178: v61.45,21.35 61.05,21.75 59.7,21.75 v57,19.05
MSEL2
  Top 0.178: IC11.70 61,11.6 56.95,15.65 42.15,15.65 41.4,14.9 35.4,14.9 34.9,15.4 22,15.4 21.1,16.3 11.45,16.3 7.75,12.6 7.75,9.75 8.65,8.85 10.35,8.85 11.15,8.05 11.15,4.45 10.2,3.5 SJ1.2
N$4
  pour Top (rank 2, no thermals): 11.65,4.3 48.2,4.25 48.2,0.25 11.65,0.25
TCK  (via drill 0.33)
  Top 0.178: IC11.62 64.7,15.6 65.2,15.1 v65.2,14.4 | v70.1,14.6 70.7,14 71.2,14 71.45,14.25 76.65,14.25 v77.15,13.75
  Bottom 0.178: JP50.TCK 77.62,13.28 v77.15,13.75 | v65.2,14.4 69.9,14.4 v70.1,14.6
TDI  (via drill 0.33)
  Top 0.178: IC11.4 77.95,10.6 76.7,11.85 71.8,11.85 69.5,14.15 69.5,15.05 73.25,18.8 v77.05,18.8
  Bottom 0.178: v77.05,18.8 78.35,18.8 78.85,18.3 JP50.TDI
TDO  (via drill 0.33)
  Top 0.178: IC11.73 64.65,10.1 64.9,10.35 64.9,12.6 v66.1,13.8 | v70.95,14.6 v77.45,14.6
  Bottom 0.178: v77.45,14.6 77.6,14.6 78.82,15.82 JP50.TDO | v70.95,14.6 70.15,13.8 v66.1,13.8
TMS  (via drill 0.33)
  Top 0.178: IC11.15 78.05,16.1 77.6,16.55 v77.6,16.6
  Bottom 0.178: v77.6,16.6 78.45,17.45 79.3,17.45 79.8,17.95 79.8,18.75 78.85,19.7 JP50.TMS 78,21.75 R50.1
VCC  (via drill 0.33)
  Top 0.178: IC19.3 80.8,0.8 80.6,1 80.6,3.25 80.8,3.45 C3.1
  Top 0.305: TP_VCC.TP 3.17,26.6 IC9.64 | IC19.1 82.65,3.05 82.25,3.45 C3.1
  Top 0.406: IC15.6 v71.5,2.1 | C2.2 68.2,2.6 v68.7,2.1 | IC16.6 v74.3,2.1 | IC17.6 v77.1,2.1 | IC18.6 v80,2.1 | IC13.6 83.8,11.05 83.4,11.45 v82.95,11.45 | IC14.6 83.8,8.3 83.4,8.7 v82.95,8.7 | IC12.6 83.8,13.85 83.45,14.2 v83.1,14.2 | IC8.6 83.8,19.45 83.5,19.75 v83.1,19.75 | IC10.6 83.8,16.6 83.5,16.9 v83.1,16.9 | IC7.6 83.8,22.25 83.5,22.55 v83.1,22.55 | IC6.6 83.8,25.05 83.5,25.35 v83.1,25.35 | C3.1 v81.4,4.95 | IC2.6 78.65,27.5 v78.35,27.8 | IC1.6 75.85,27.5 v75.55,27.8 | IC4.6 72.95,27.4 v72.8,27.55 | IC3.6 70.15,27.4 v70,27.55 | IC5.6 67.15,27.1 v66.85,27.4 | v30.75,16 27.85,16 v27.4,16.45 | v21.45,22.1 26.85,22.1 v27.4,21.55 | U1.64 IC9.64
  Bottom 0.305: C50.2 33.2,15.95 IC20.8 30.8,15.95 v30.75,16
  Bottom 0.406: 3.14,22.5 3.14,22.4 C74.2 C75.2 | 3.14,22.5 U1.64 | C76.2 v83.1,25.35 | v82.95,8.7 82.8,8.7 82.1,8 82.1,5.1 81.95,4.95 v81.4,4.95 | v70,27.55 68.95,28.6 5.17,28.6 IC9.64 | v27.4,21.55 v27.4,16.45 | v21.45,22.1 21.2,22.35 3.29,22.35 3.14,22.5
  pour Top: 80.05,5.45 82.65,5.45 82.65,0.1 78.4,0.1 78.45,2.65 80.05,2.65
  pour Bottom: 82.4,5.45 82.4,4.5 81.2,4.5 80.45,5.25 80.45,5.4 80.5,5.45
  pour Bottom: 67.1,1.5 67.1,2.7 70.7,2.7 71.1,2.75 80.1,2.75 80.5,2.35 82.6,2.4 82.6,2 82.1,1.5
  pour Bottom: 65.35,28.8 65.35,28.5 66.75,27.1 80.8,27.1 82.35,25.55 82.35,23.45 82.45,23.35 82.45,17.35 82.15,17.05 82.15,9.35 81.75,8.95 81.75,5.45 82.4,5.45 82.4,7.65 83.6,7.65 83.6,25.9 82.5,25.9 82.5,26.7 82.85,27.05 82.6,27.3 82.6,27.65 82.35,27.9 82.15,27.7 81.55,27.7 80.45,28.8
VCC_CPLD  (via drill 0.33)
  Top 0.305: v65.1,20.85 64.85,21.1 IC11.51 | v70.75,21.3 70.85,21.4 IC11.39 70.85,23.9 v70.65,24.1 70.65,24.8 70.7,24.85 | v73.6,21.3 73.35,21.55 IC11.34 | v77.55,17.6 IC11.18 | v72.85,8.75 IC11.91 | v68.45,9.1 68.45,8.6 68.35,8.5 IC11.82 | v65.05,13.6 IC11.66 | IC15.1 70.75,5.05 v70.25,5.55 | IC16.1 73.55,4.4 73.7,4.55 73.7,5.65 v73.65,5.7 | v76.35,5.55 IC17.1 | v79.2,5.55 IC18.1 | v80.55,7.95 80.6,7.9 81.4,7.9 81.5,7.8 IC14.1 | v81.05,10.8 81.25,10.6 IC13.1 | v81.05,13.45 81.1,13.4 IC12.1 | v81.05,19.3 81.25,19.3 81.55,19 IC8.1 | v81.05,22.1 81.35,21.8 IC7.1 | v80.35,16.25 81.45,16.25 81.5,16.2 IC10.1 | v73.3,24.45 73.5,24.65 IC4.1 | v79,23.9 79,25 79.1,25.1 IC2.1 | v67.85,23.9 67.85,24.4 67.65,24.6 IC5.1 | IC1.1 76.3,24.75 v76.35,24.7 | IC6.1 81.35,24.6 v81.05,24.9 82.5,26.35 v83.15,26.35 | 70.7,24.85 | 70.7,24.85 IC3.1 | v77.55,10.1 IC11.3
  Top 0.406: IC19.5 C1.1 85.15,4.75 84,5.9 80.55,5.9 v79.95,6.5 77.55,8.9 v77.55,10.1
  Bottom 0.178: v73.6,21.3 74.05,21.75 R50.2
  Bottom 0.305: 70.25,5.6 v70.25,5.55 70.15,5.65 | 81,10.8 v81.05,10.8 | 79.2,5.5 v79.2,5.55 79.2,5.75 | 81,13.45 v81.05,13.45 | 81,19.3 v81.05,19.3 | 70.65,24.05 v70.65,24.1 | 80.1,23.9 80.1,24.05 | 80.95,24.9 v81.05,24.9 | 73.3,24.35 v73.3,24.45 | JP50.VCC 77.55,9.5 v77.55,10.1 | v83.15,26.35 83.6,26.8 C77.2 | 73.6,5.75 v73.65,5.7 | 73.9,23.75 | v76.35,24.7
  Bottom 0.406: 70.25,5.6 72.55,5.6 72.7,5.75 73.6,5.75 | v79.2,5.55 79,5.75 76.55,5.75 v76.35,5.55 76.15,5.75 73.7,5.75 v73.65,5.7 | 81,10.8 80.4,10.2 80.4,8.1 v80.55,7.95 80.4,7.8 80.4,6.95 v79.95,6.5 79.2,5.75 | v81.05,10.8 80.35,11.5 80.35,12.8 81,13.45 | v81.05,13.45 80.35,14.15 v80.35,16.25 80.35,18.65 81,19.3 | v81.05,19.3 80.25,20.1 80.25,21.5 80.85,22.1 v81.05,22.1 80.1,23.05 80.1,23.9 v79,23.9 77.15,23.9 v76.35,24.7 75.4,23.75 73.9,23.75 73.3,24.35 | v70.65,24.1 70.2,23.65 68.1,23.65 v67.85,23.9 | v73.3,24.45 72.95,24.45 71.9,23.4 71.3,23.4 70.65,24.05 | 80.1,24.05 80.95,24.9 | C52.2 70.15,5.65 | v77.55,17.6 77,17.05 C64.2 | C64.2 C63.2 76.45,13.45 77.55,12.35 v77.55,10.1 77.55,10 C53.2 C54.2 C55.2 | C66.2 74.55,20.25 76.45,18.35 C64.2 | C66.2 C67.2 | C66.2 v73.6,21.3 | v70.75,21.3 70.75,20.25 C68.2 C69.2 68.65,20.25 68.05,20.85 C70.2 C71.2 v65.1,20.85 | v72.85,8.75 73.4,9.3 C55.2 | C55.2 C56.2 71.3,10 70.95,10.35 C57.2 C58.2 | v68.45,9.1 68.9,9.55 C58.2 | C58.2 68.25,10.35 67.45,9.55 65.8,9.55 65.05,10.3 C59.2 C62.2 v65.05,13.6 | 79.2,5.75
  pour Top (no thermals): 77.5,8.3 78.2,9 79.7,9 79.9,8.8 79.9,8.4 79.6,8.1 79.6,7.5 80.7,6.4 81.6,6.4 81.6,5.9 79.8,5.9 79.4,6.3 77.95,6.3 77.5,6.75

### Text on the board
Top: ToyoTune LVC 2.0 | Copyright 2014, Powertrain Logic LLP
bPlace: TMS | TDI | TDO | TCK | GND | VCC
tStop: ToyoTune LVC 2.0 | Copyright 2014, Powertrain Logic LLP